# Altium schematic sheet acf_schematic_gost.SchDoc: Устройство сжатия
size 1188 x 840 mm; CheckedBy: Леонидов В.В.; Author: Добротин А.А.; DocumentNumber: ИУ4.11.03.03.24.08.81.07.000 Э3; SheetNumber: 1; SheetTotal: 4; CompanyName1: МГТУ им. Н.Э.Баумана; CompanyName2: Кафедра ИУ4; CompanyName3: Группа ИУ4-81Б; Title2str: аудиоданных; DocumentType: Схема электрическая принципиальная; FirstReferrence: ИУ4.11.03.03.24.08.81.07.000; SheetN: 1; SheetT: 1; ListNumber: 1; Разработал: Добротин А.А.; Проверил: Леонидов В.В.; Наименование1: Устройство для сжатия; Наименование2: аудиоданных; Компания1: МГТУ им. Н.Э. Баумана; Компания: Кафедра ИУ4; Компания2: Группа ИУ4-81Б; Обозначение: ИУ4.11.03.03.24.08.81.07.000 Э3; ТипДокумента: Схема электрическая принципиальная; Лист: 1; Листов: 1
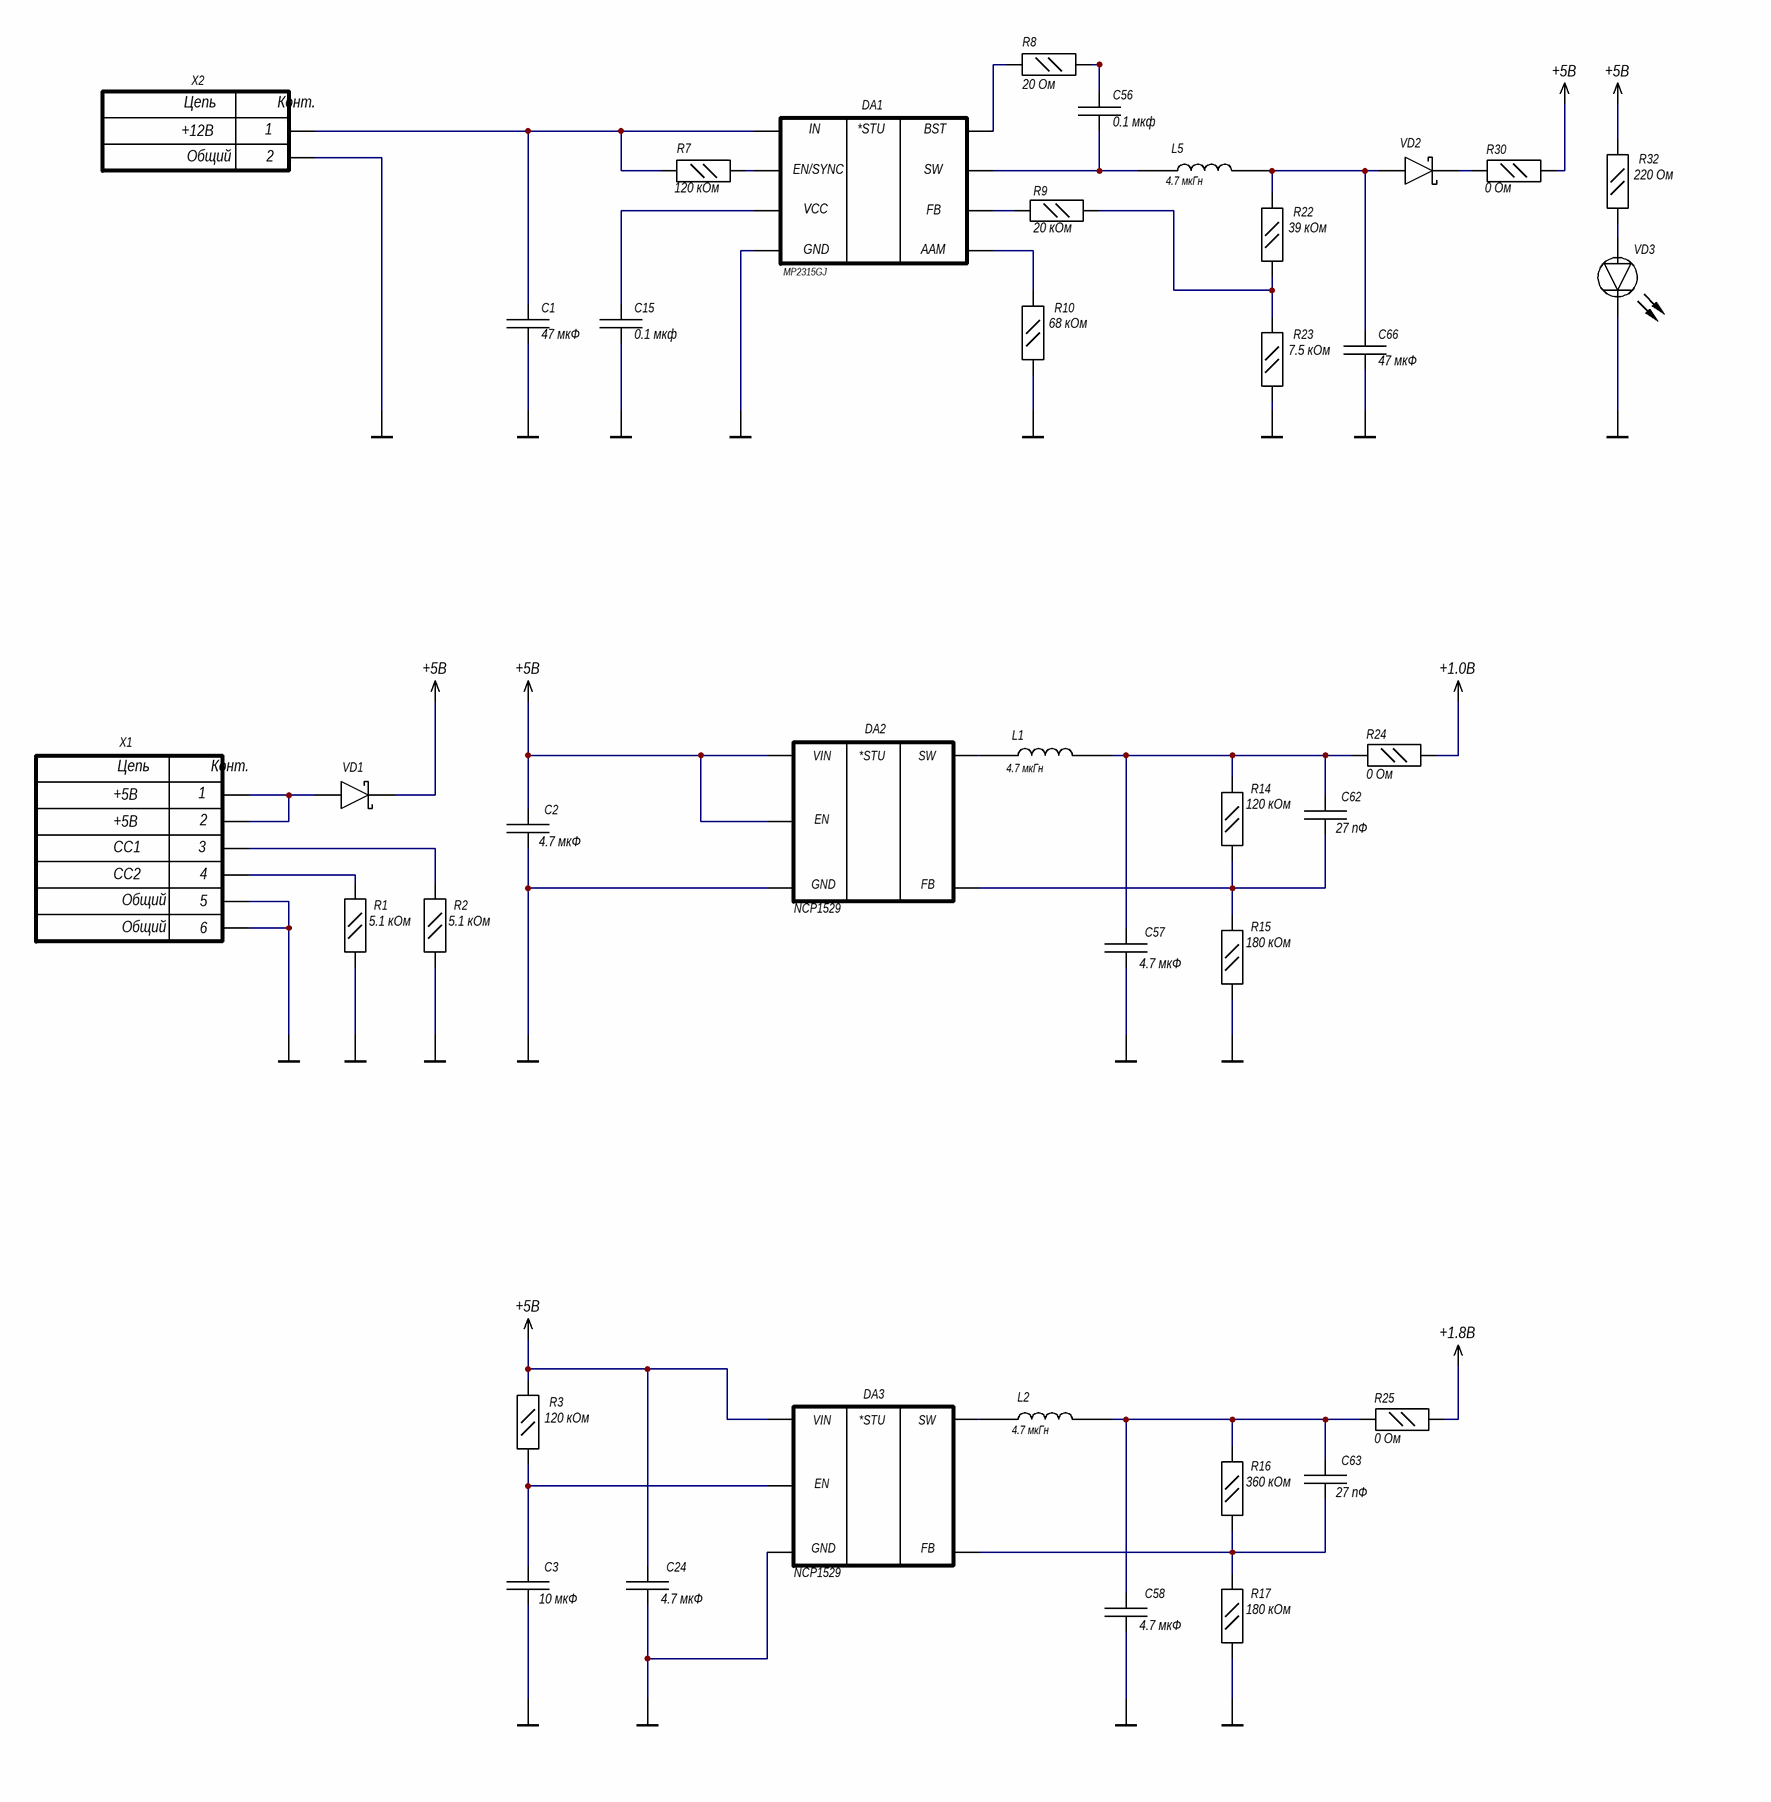
[diagram p0: acf_schematic_gost.SchDoc, top left]
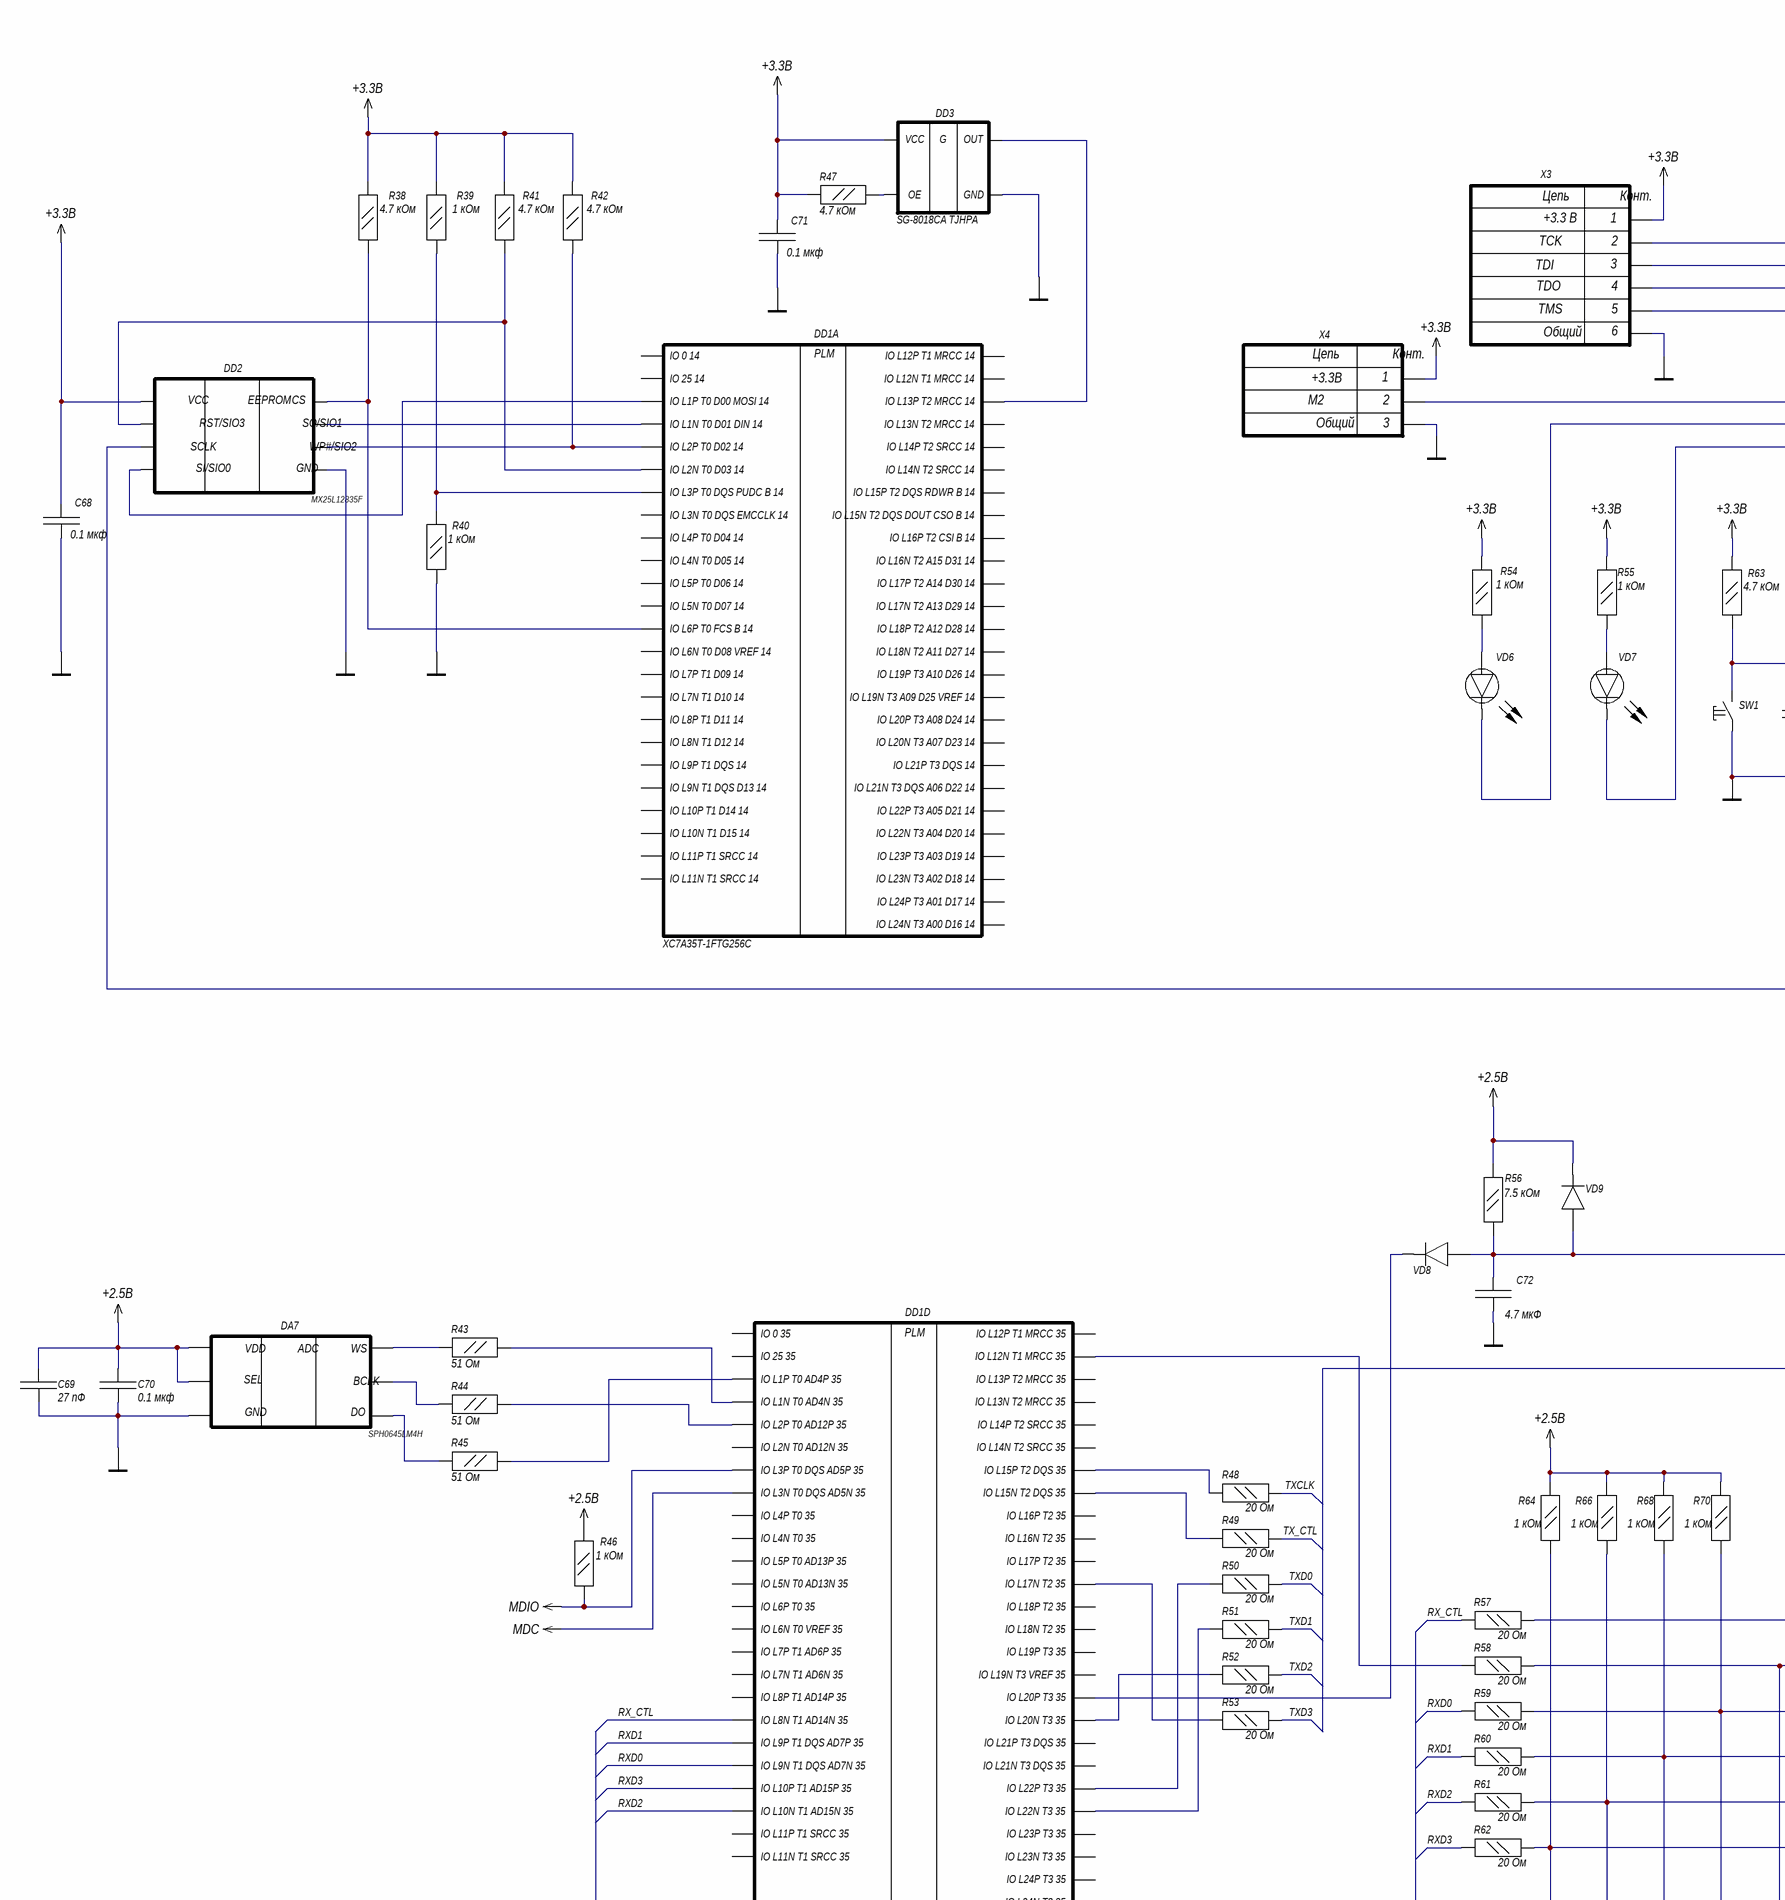
[diagram p1: acf_schematic_gost.SchDoc, top middle]
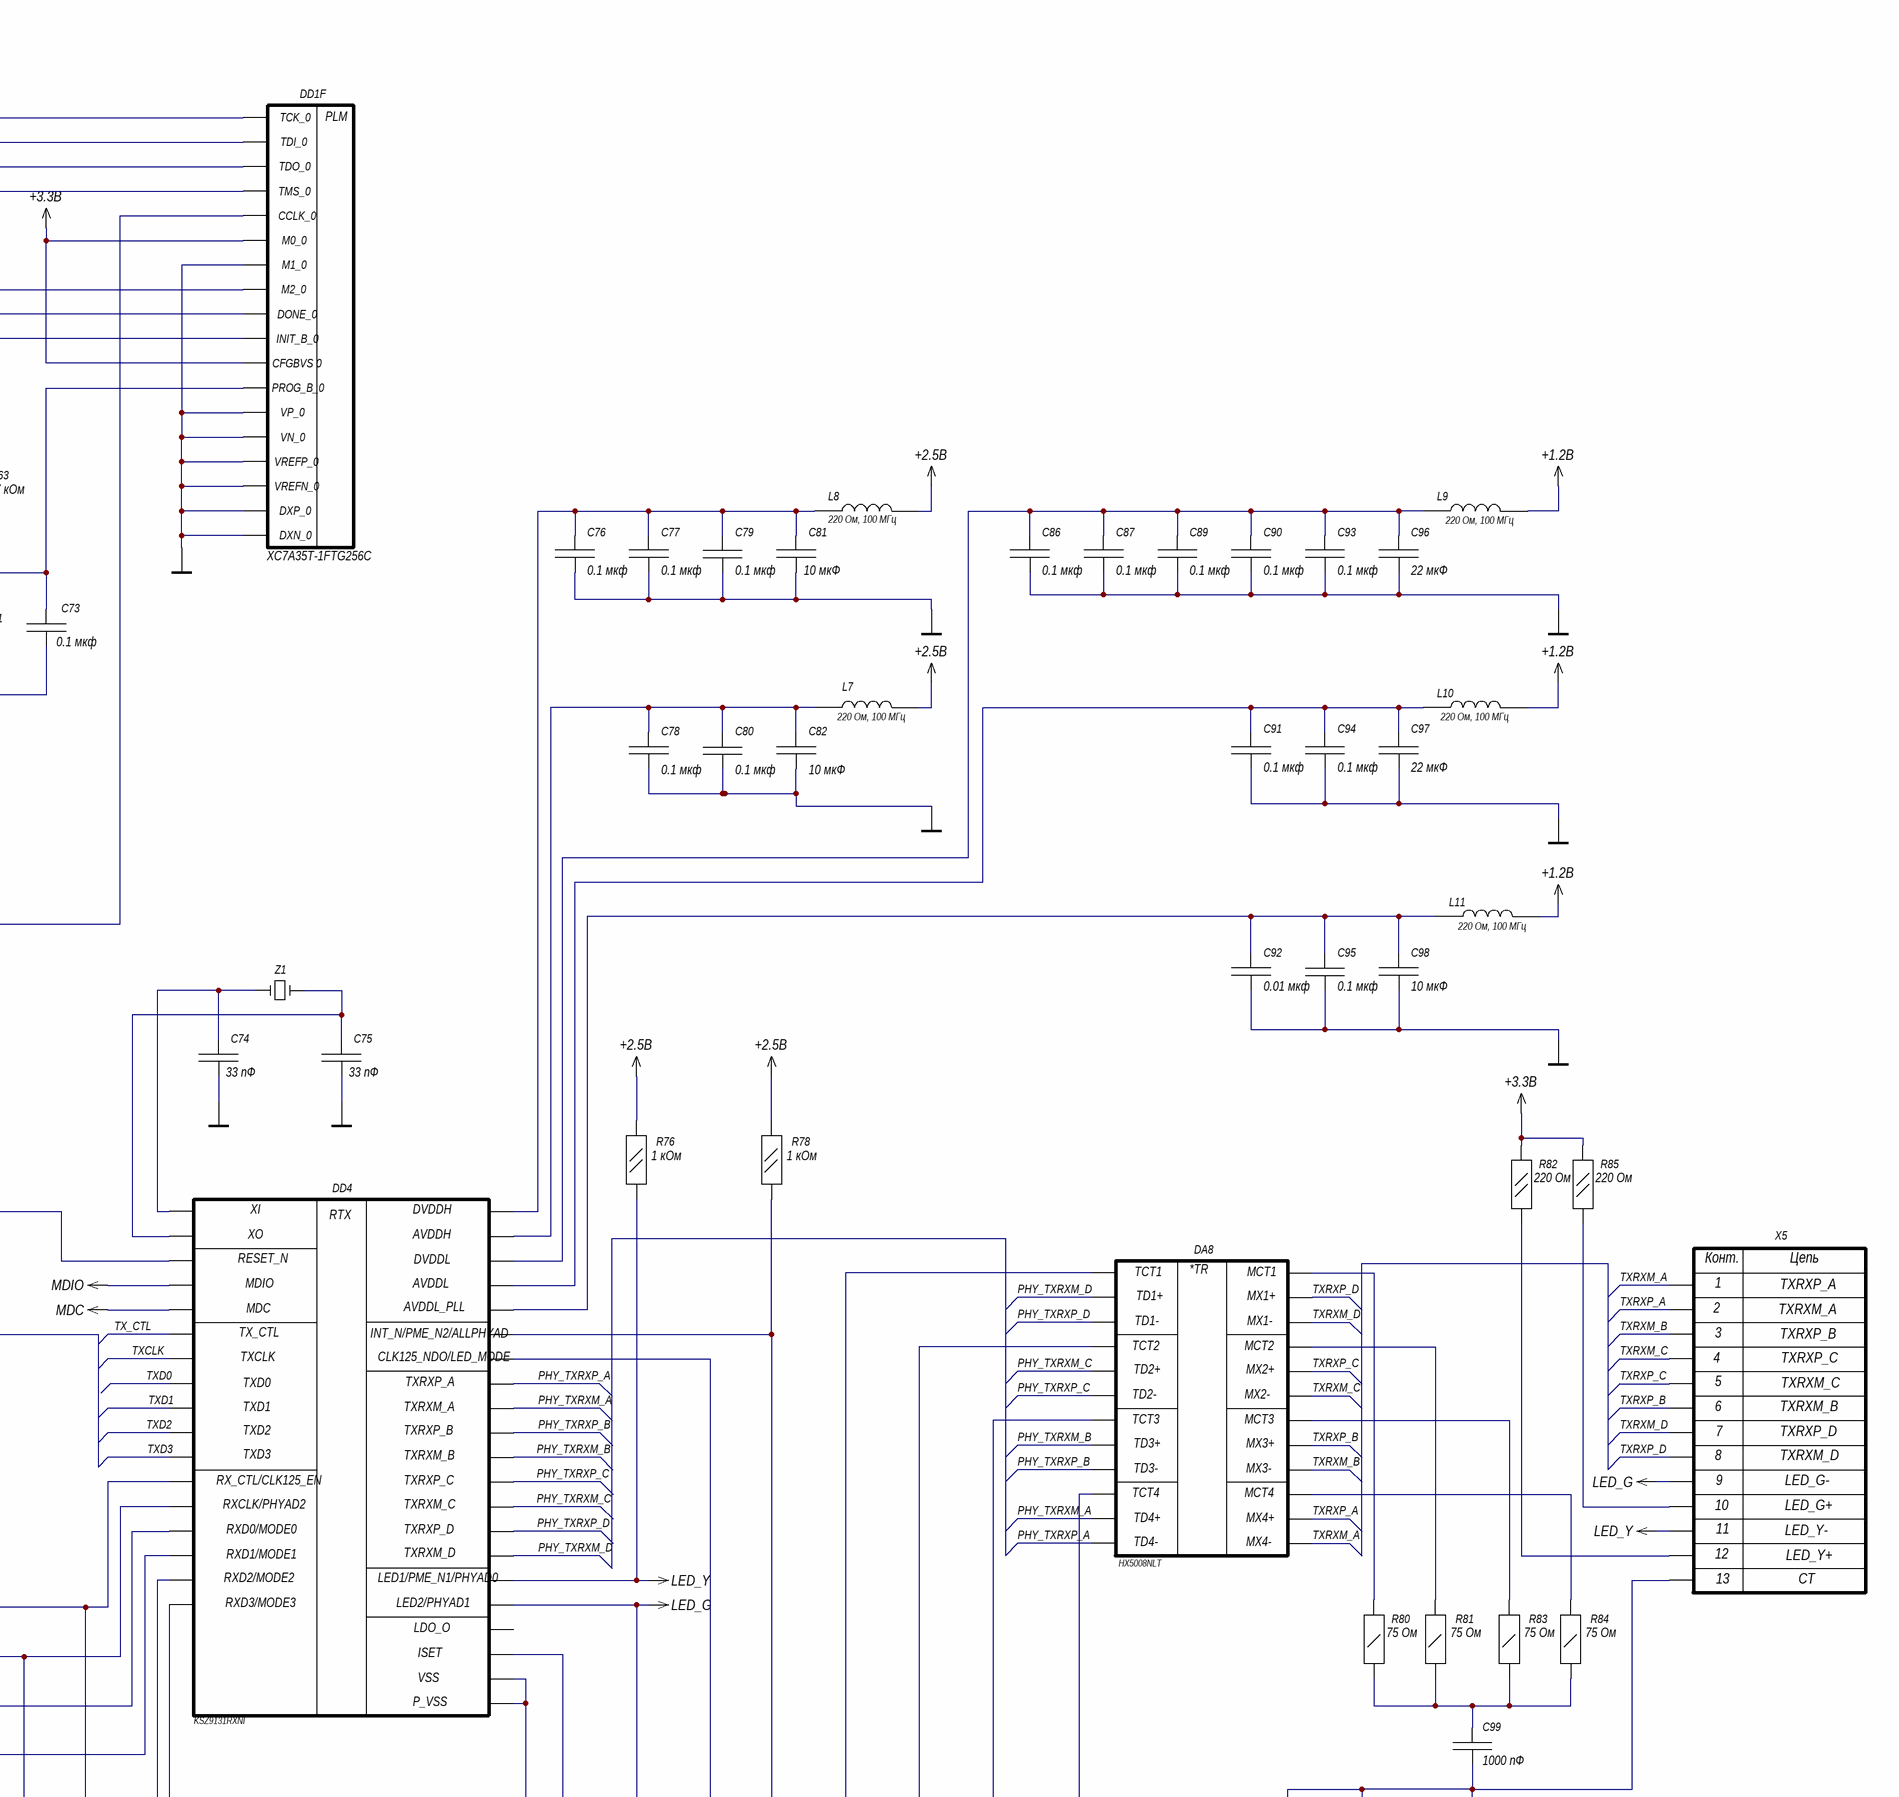
[diagram p2: acf_schematic_gost.SchDoc, top right]
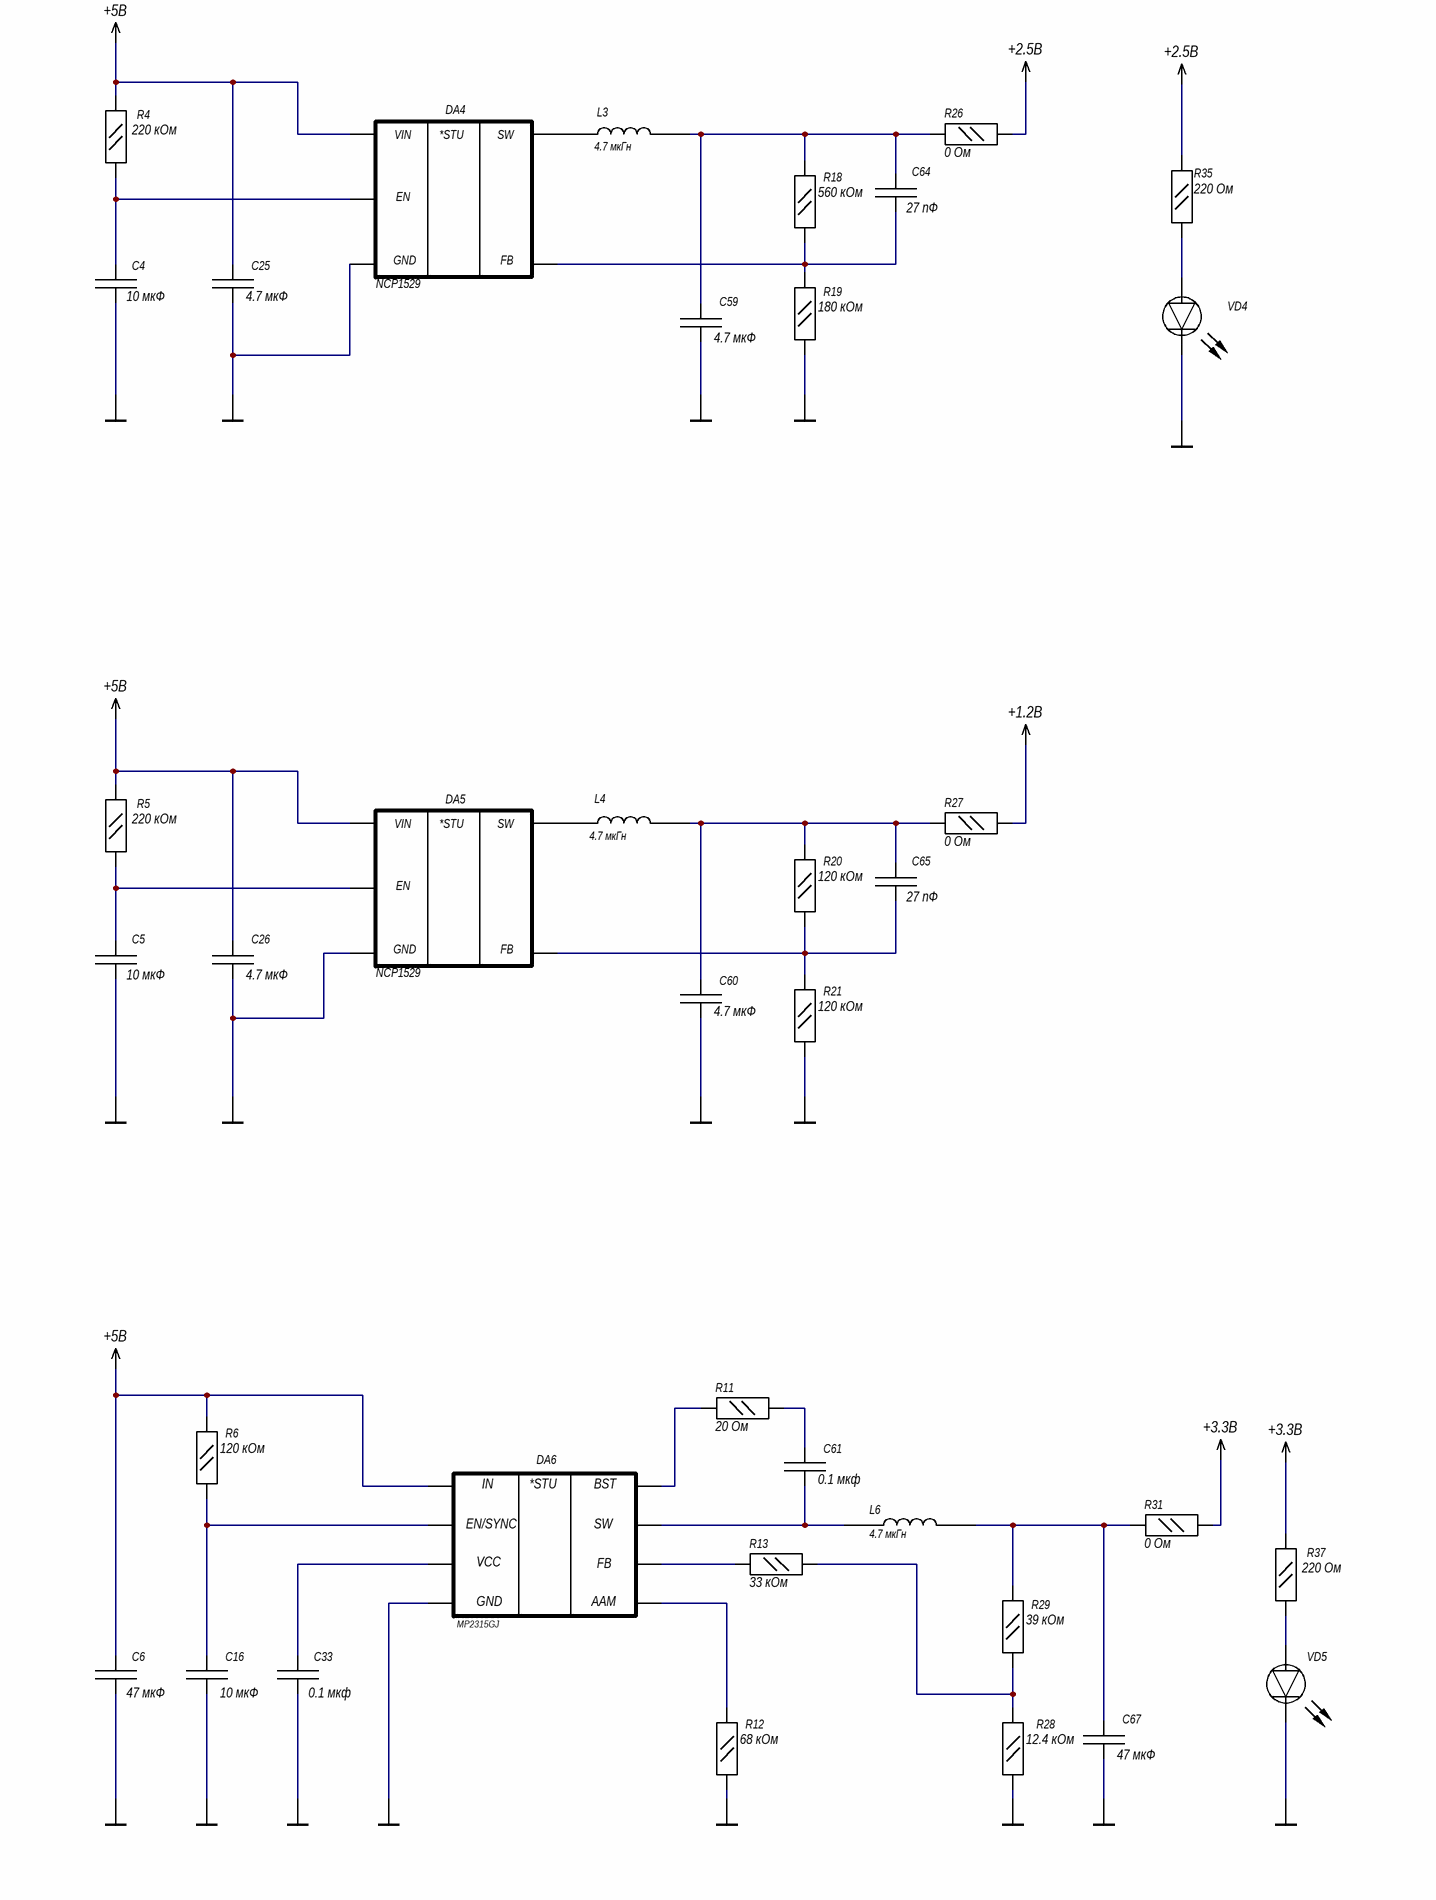
[diagram p3: acf_schematic_gost.SchDoc, bottom left]
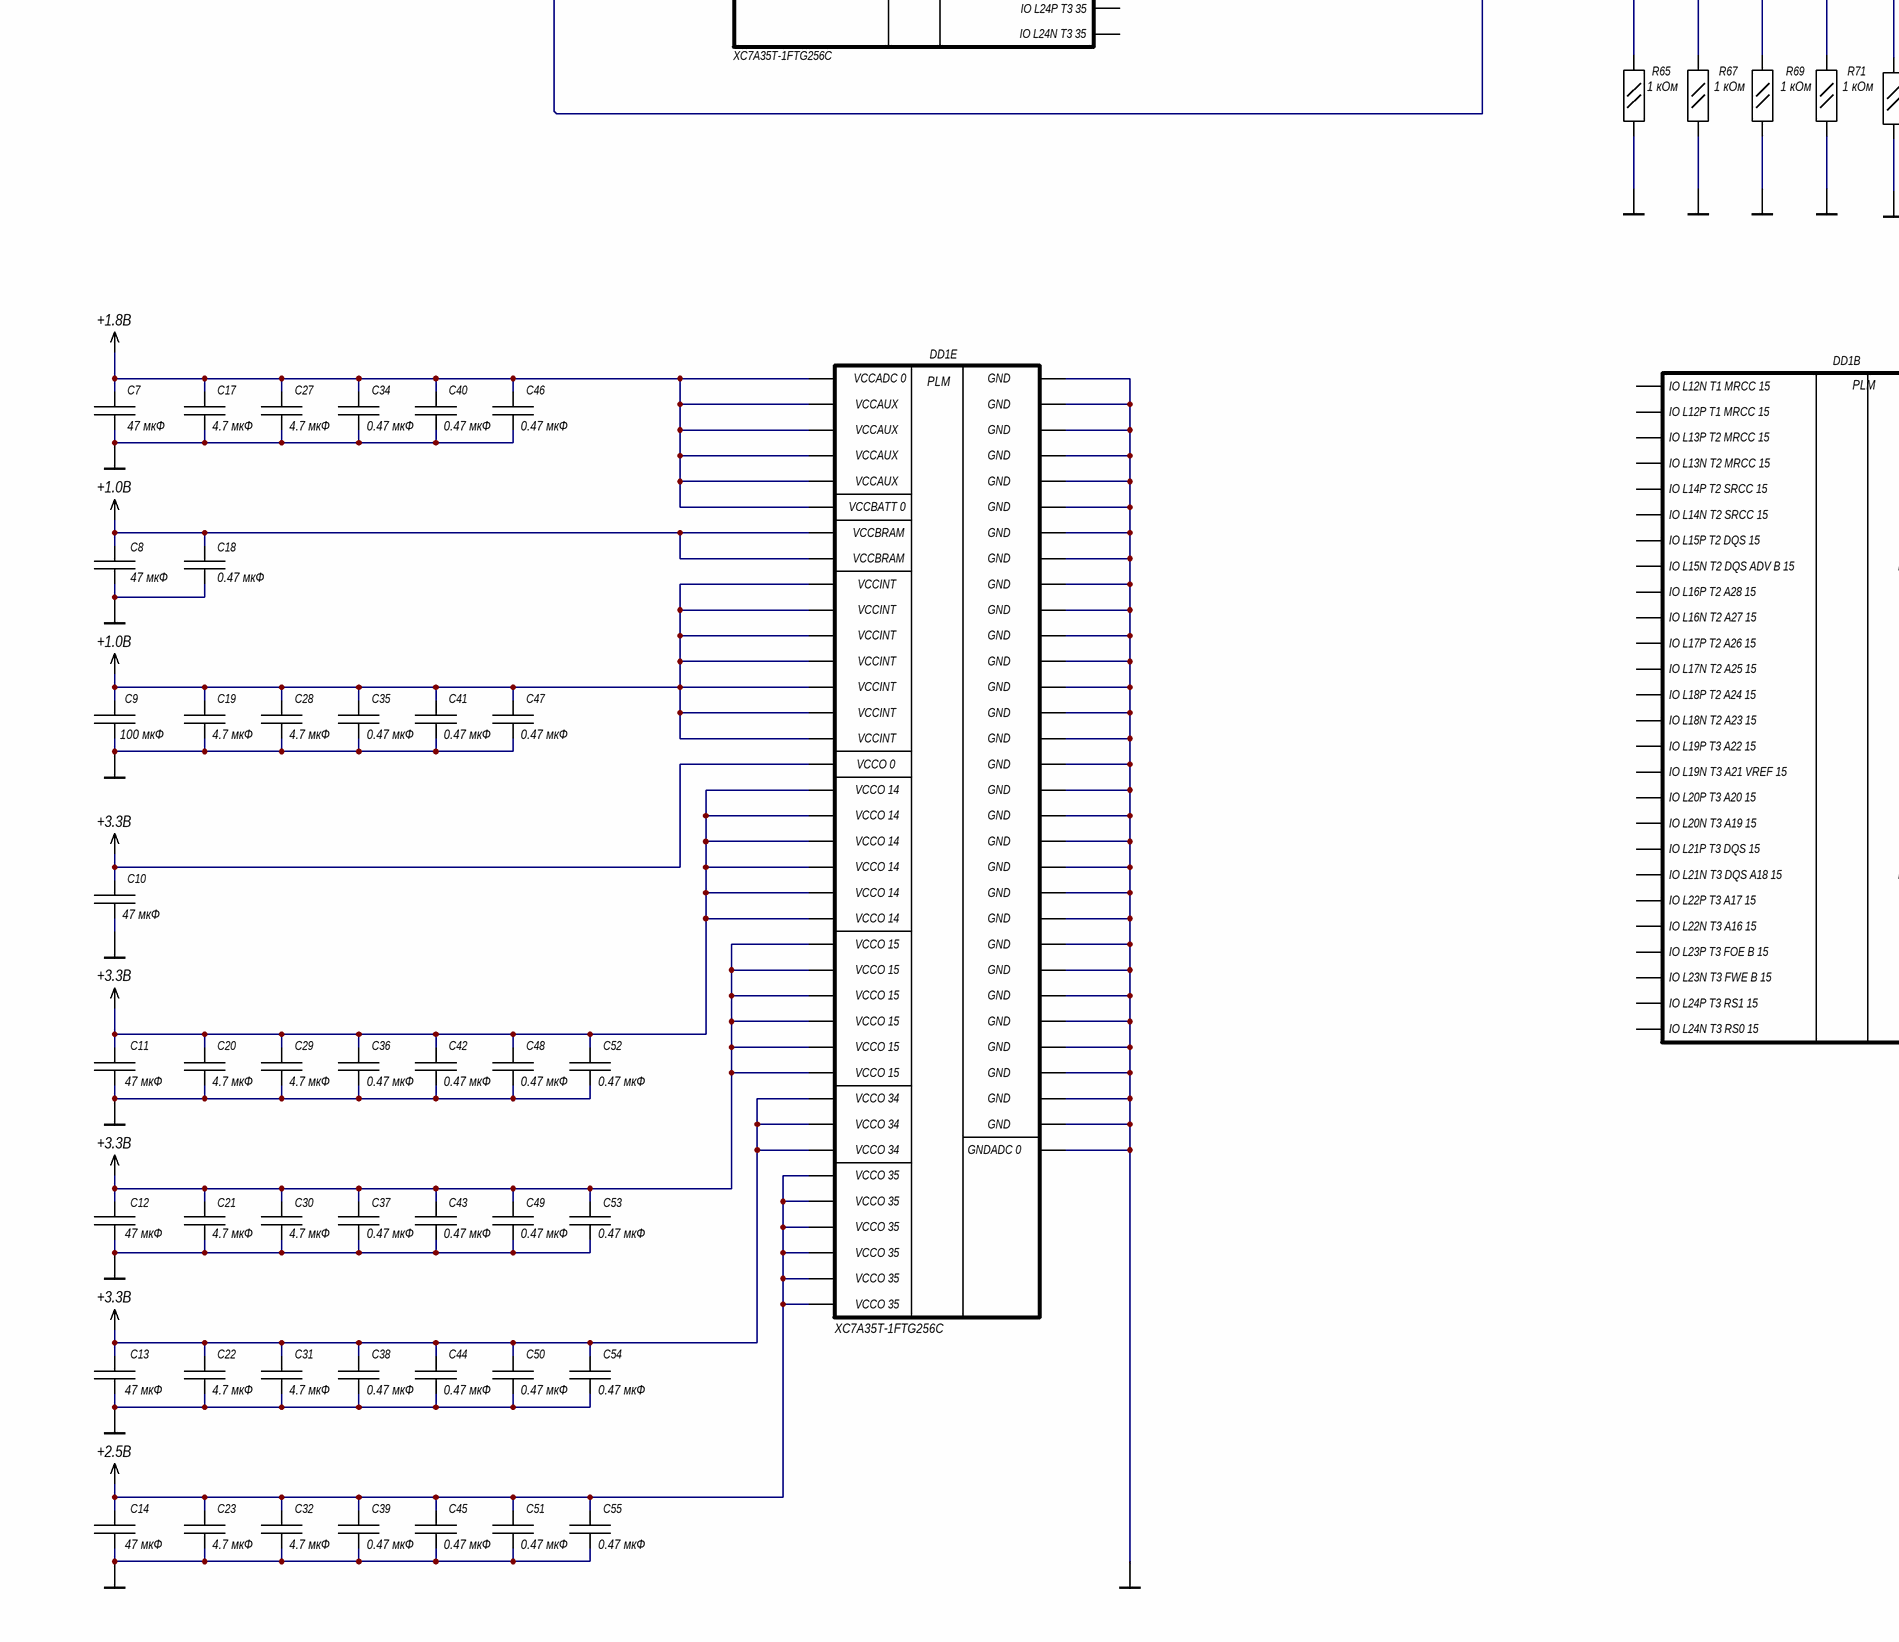
[diagram p4: acf_schematic_gost.SchDoc, bottom middle]
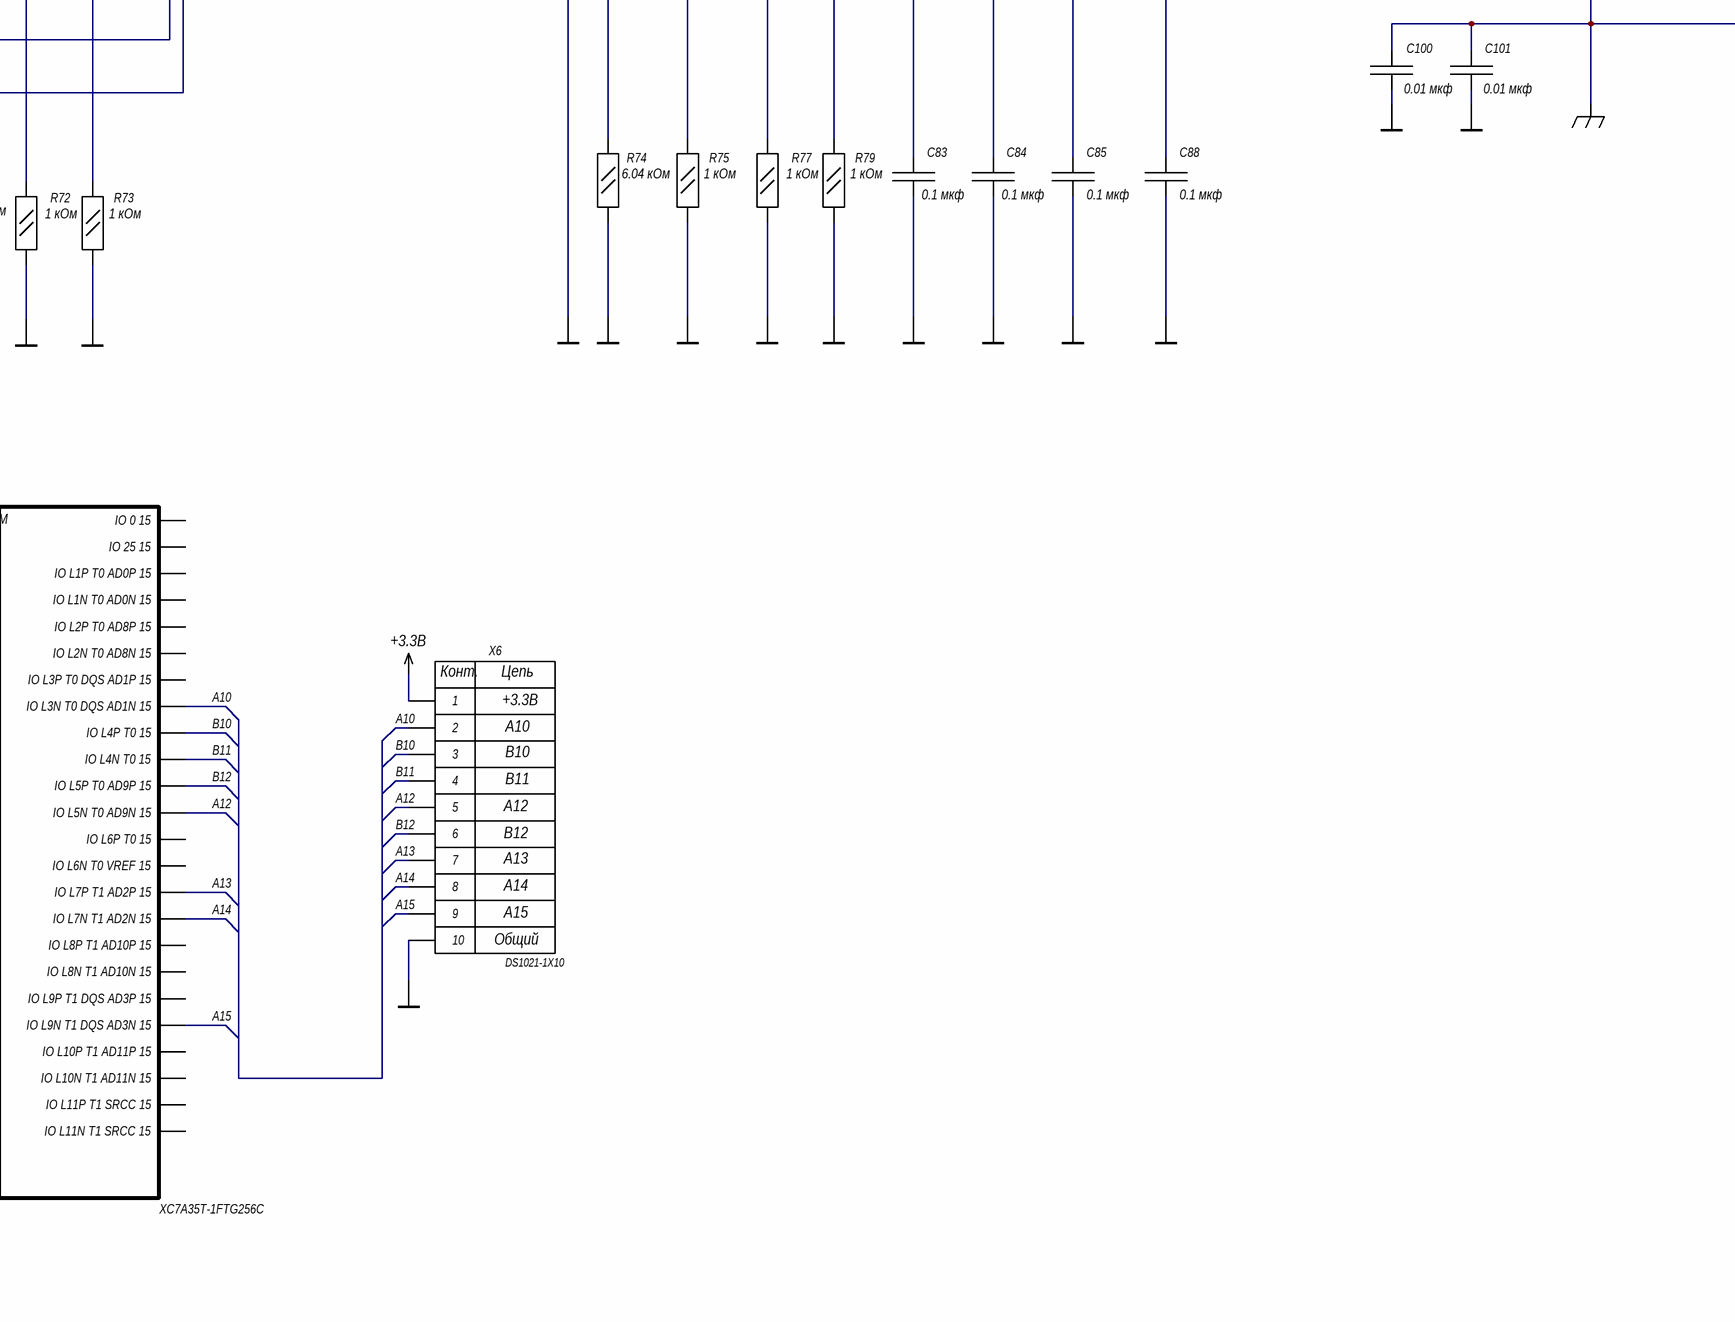
[diagram p5: acf_schematic_gost.SchDoc, bottom right]

## Parts
C1  47 мкф  [1206_Med_Dens_murata]
C2  CL10A475KP8NNNC  [CC0603-DA-IPC_B]  (value not drawn)
C3  Значение: 10 мкФ  [CC0603-DA-IPC_B]  (hidden comment: CL10A106KQ8NNNC)
C4  Значение: 10 мкФ  [CC0603-DA-IPC_B]  (hidden comment: CL10A106KQ8NNNC)
C5  Значение: 10 мкФ  [CC0603-DA-IPC_B]  (hidden comment: CL10A106KQ8NNNC)
C6  47 мкф  [0805_MED_DENS_MURATA]
C7  47 мкф  [0805_MED_DENS_MURATA]
C8  47 мкф  [0805_MED_DENS_MURATA]
C9  100 мкФ  [1206_IPC_A_samsung]
C10  47 мкф  [0805_MED_DENS_MURATA]
C11  47 мкф  [0805_MED_DENS_MURATA]
C12  47 мкф  [0805_MED_DENS_MURATA]
C13  47 мкф  [0805_MED_DENS_MURATA]
C14  47 мкф  [0805_MED_DENS_MURATA]
C15  Значение: 0.1 мкф  [CC0603-DA-IPC_B]  (hidden comment: 0.1 мкф (0603))
C16  Значение: 10 мкФ  [CC0603-DA-IPC_B]  (hidden comment: CL10A106KQ8NNNC)
C17  4.7 мкф  [CC0603-DA-IPC_B]
C18  0.47 мкф  [CC0603-DA-IPC_B]
C19  4.7 мкф  [CC0603-DA-IPC_B]
C20  4.7 мкф  [CC0603-DA-IPC_B]
C21  4.7 мкф  [CC0603-DA-IPC_B]
C22  4.7 мкф  [CC0603-DA-IPC_B]
C23  4.7 мкф  [CC0603-DA-IPC_B]
C24  CL10A475KP8NNNC  [CC0603-DA-IPC_B]  (value not drawn)
C25  CL10A475KP8NNNC  [CC0603-DA-IPC_B]  (value not drawn)
C26  CL10A475KP8NNNC  [CC0603-DA-IPC_B]  (value not drawn)
C27  4.7 мкф  [CC0603-DA-IPC_B]
C28  4.7 мкф  [CC0603-DA-IPC_B]
C29  4.7 мкф  [CC0603-DA-IPC_B]
C30  4.7 мкф  [CC0603-DA-IPC_B]
C31  4.7 мкф  [CC0603-DA-IPC_B]
C32  4.7 мкф  [CC0603-DA-IPC_B]
C33  Значение: 0.1 мкф  [CC0603-DA-IPC_B]  (hidden comment: 0.1 мкф (0603))
C34  0.47 мкф  [CC0603-DA-IPC_B]
C35  0.47 мкф  [CC0603-DA-IPC_B]
C36  0.47 мкф  [CC0603-DA-IPC_B]
C37  0.47 мкф  [CC0603-DA-IPC_B]
C38  0.47 мкф  [CC0603-DA-IPC_B]
C39  0.47 мкф  [CC0603-DA-IPC_B]
C40  0.47 мкф  [CC0603-DA-IPC_B]
C41  0.47 мкф  [CC0603-DA-IPC_B]
C42  0.47 мкф  [CC0603-DA-IPC_B]
C43  0.47 мкф  [CC0603-DA-IPC_B]
C44  0.47 мкф  [CC0603-DA-IPC_B]
C45  0.47 мкф  [CC0603-DA-IPC_B]
C46  0.47 мкф  [CC0603-DA-IPC_B]
C47  0.47 мкф  [CC0603-DA-IPC_B]
C48  0.47 мкф  [CC0603-DA-IPC_B]
C49  0.47 мкф  [CC0603-DA-IPC_B]
C50  0.47 мкф  [CC0603-DA-IPC_B]
C51  0.47 мкф  [CC0603-DA-IPC_B]
C52  0.47 мкф  [CC0603-DA-IPC_B]
C53  0.47 мкф  [CC0603-DA-IPC_B]
C54  0.47 мкф  [CC0603-DA-IPC_B]
C55  0.47 мкф  [CC0603-DA-IPC_B]
C56  Значение: 0.1 мкф  [CC0603-DA-IPC_B]  (hidden comment: 0.1 мкф (0603))
C57  CL10A475KP8NNNC  [CC0603-DA-IPC_B]  (value not drawn)
C58  CL10A475KP8NNNC  [CC0603-DA-IPC_B]  (value not drawn)
C59  CL10A475KP8NNNC  [CC0603-DA-IPC_B]  (value not drawn)
C60  CL10A475KP8NNNC  [CC0603-DA-IPC_B]  (value not drawn)
C61  Значение: 0.1 мкф  [CC0603-DA-IPC_B]  (hidden comment: 0.1 мкф (0603))
C62  CL21C270JBANNNC  [0805_MED_DENS_MURATA]  (value not drawn)
C63  CL21C270JBANNNC  [0805_MED_DENS_MURATA]  (value not drawn)
C64  CL21C270JBANNNC  [0805_MED_DENS_MURATA]  (value not drawn)
C65  CL21C270JBANNNC  [0805_MED_DENS_MURATA]  (value not drawn)
C66  GRM21BR60J476ME15L  [0805_MED_DENS_MURATA]  (value not drawn)
C67  GRM21BR60J476ME15L  [0805_MED_DENS_MURATA]  (value not drawn)
C68  Значение: 0.1 мкф  [CC0603-DA-IPC_B]  (hidden comment: 0.1 мкф (0603))
C69  27 пф  [0805_MED_DENS_MURATA]
C70  Значение: 0.1 мкф  [CC0603-DA-IPC_B]  (hidden comment: 0.1 мкф (0603))
C71  Значение: 0.1 мкф  [CC0603-DA-IPC_B]  (hidden comment: 0.1 мкф (0603))
C72  4.7 мкф  [CC0603-DA-IPC_B]
C73  Значение: 0.1 мкф  [CC0603-DA-IPC_B]  (hidden comment: 0.1 мкф (0603))
C74  33 пФ  [CC0603-DA-IPC_B]
C75  33 пФ  [CC0603-DA-IPC_B]
C76  Значение: 0.1 мкф  [CC0603-DA-IPC_B]  (hidden comment: 0.1 мкф (0603))
C77  Значение: 0.1 мкф  [CC0603-DA-IPC_B]  (hidden comment: 0.1 мкф (0603))
C78  Значение: 0.1 мкф  [CC0603-DA-IPC_B]  (hidden comment: 0.1 мкф (0603))
C79  Значение: 0.1 мкф  [CC0603-DA-IPC_B]  (hidden comment: 0.1 мкф (0603))
C80  Значение: 0.1 мкф  [CC0603-DA-IPC_B]  (hidden comment: 0.1 мкф (0603))
C81  10 мкф  [CC0603-DA-IPC_B]
C82  10 мкф  [CC0603-DA-IPC_B]
C83  Значение: 0.1 мкф  [CC0603-DA-IPC_B]  (hidden comment: 0.1 мкф (0603))
C84  Значение: 0.1 мкф  [CC0603-DA-IPC_B]  (hidden comment: 0.1 мкф (0603))
C85  Значение: 0.1 мкф  [CC0603-DA-IPC_B]  (hidden comment: 0.1 мкф (0603))
C86  Значение: 0.1 мкф  [CC0603-DA-IPC_B]  (hidden comment: 0.1 мкф (0603))
C87  Значение: 0.1 мкф  [CC0603-DA-IPC_B]  (hidden comment: 0.1 мкф (0603))
C88  Значение: 0.1 мкф  [CC0603-DA-IPC_B]  (hidden comment: 0.1 мкф (0603))
C89  Значение: 0.1 мкф  [CC0603-DA-IPC_B]  (hidden comment: 0.1 мкф (0603))
C90  Значение: 0.1 мкф  [CC0603-DA-IPC_B]  (hidden comment: 0.1 мкф (0603))
C91  Значение: 0.1 мкф  [CC0603-DA-IPC_B]  (hidden comment: 0.1 мкф (0603))
C92  0.01 мкф  [CC0603-DA-IPC_B]
C93  Значение: 0.1 мкф  [CC0603-DA-IPC_B]  (hidden comment: 0.1 мкф (0603))
C94  Значение: 0.1 мкф  [CC0603-DA-IPC_B]  (hidden comment: 0.1 мкф (0603))
C95  Значение: 0.1 мкф  [CC0603-DA-IPC_B]  (hidden comment: 0.1 мкф (0603))
C96  22 мкФ  [0805_MED_DENS_MURATA]
C97  22 мкФ  [0805_MED_DENS_MURATA]
C98  10 мкф  [CC0603-DA-IPC_B]
C99  1000 пФ  [CAP 1808]
C100  0.01 мкф  [CC0603-DA-IPC_B]
C101  0.01 мкф  [CC0603-DA-IPC_B]
DA1  DC-DC  [TSTO23-8]  (value not drawn)
DA2  DC-DC  [TSOT23-5 (TSOP5)]  (value not drawn)
DA3  DC-DC  [TSOT23-5 (TSOP5)]  (value not drawn)
DA4  DC-DC  [TSOT23-5 (TSOP5)]  (value not drawn)
DA5  DC-DC  [TSOT23-5 (TSOP5)]  (value not drawn)
DA6  DC-DC  [TSTO23-8]  (value not drawn)
DA7  Microphone  [MIC_SPH0645LM4H-B]  (value not drawn)
DA8  Magnetics (ethernet)  [FP-HX5008NL-MFG]  (value not drawn)
DD1  FPGA  [FP-XC7A35T-1FTG256C-MFG]  (value not drawn)  (parts A,B,D,E,F of 6)
DD2  QSPI Flash  [MX25L12835FM2I-10G]  (value not drawn)
DD3  SG-8018CA TJHPA  [OSC_SG-8018CA_50.2600M-TJHPA0]  (value not drawn)
DD4  PHY ETH  [FP-QFN77-48LD-PL-1-MFG]  (value not drawn)
L1  VLS6045EX-4R7M-H  [IND_VLS6045EX-4R7M-H]  (value not drawn)
L2  VLS6045EX-4R7M-H  [IND_VLS6045EX-4R7M-H]  (value not drawn)
L3  VLS6045EX-4R7M-H  [IND_VLS6045EX-4R7M-H]  (value not drawn)
L4  VLS6045EX-4R7M-H  [IND_VLS6045EX-4R7M-H]  (value not drawn)
L5  VLS6045EX-4R7M-H  [IND_VLS6045EX-4R7M-H]  (value not drawn)
L6  VLS6045EX-4R7M-H  [IND_VLS6045EX-4R7M-H]  (value not drawn)
L7  Значение: 220 Ом, 100 МГц  [MMZ1608-0_8-MFG]  (hidden comment: Ферритовый фильтр 220 Ом 100 МГц)
L8  Значение: 220 Ом, 100 МГц  [MMZ1608-0_8-MFG]  (hidden comment: Ферритовый фильтр 220 Ом 100 МГц)
L9  Значение: 220 Ом, 100 МГц  [MMZ1608-0_8-MFG]  (hidden comment: Ферритовый фильтр 220 Ом 100 МГц)
L10  Значение: 220 Ом, 100 МГц  [MMZ1608-0_8-MFG]  (hidden comment: Ферритовый фильтр 220 Ом 100 МГц)
L11  Значение: 220 Ом, 100 МГц  [MMZ1608-0_8-MFG]  (hidden comment: Ферритовый фильтр 220 Ом 100 МГц)
R1  5.1 кОм  [RESC2012X60N (0805)]
R2  5.1 кОм  [RESC2012X60N (0805)]
R3  120 кОм  [RESC2012X60N (0805)]
R4  RC0603FR-07220KL  [RESC1608X55X25(0603 res)]  (value not drawn)
R5  RC0603FR-07220KL  [RESC1608X55X25(0603 res)]  (value not drawn)
R6  120 кОм  [RESC2012X60N (0805)]
R7  120 кОм  [RESC2012X60N (0805)]
R8  20 Ом  [RESC2012X60N (0805)]
R9  20 кОм  [RESC1608X55X25(0603 res)]
R10  68 кОм  [RESC2012X60N (0805)]
R11  20 Ом  [RESC2012X60N (0805)]
R12  68 кОм  [RESC2012X60N (0805)]
R13  33 кОм  [RESC2012X60N (0805)]
R14  120 кОм  [RESC2012X60N (0805)]
R15  RC0603FR-07180KL  [RESC1608X55X25(0603 res)]  (value not drawn)
R16  RC0805FR-07360KL  [RESC2012X60N (0805)]  (value not drawn)
R17  RC0603FR-07180KL  [RESC1608X55X25(0603 res)]  (value not drawn)
R18  560 кОм  [RESC2012X60N (0805)]
R19  180 кОм  [RESC1608X55X25(0603 res)]
R20  120 кОм  [RESC2012X60N (0805)]
R21  120 кОм  [RESC2012X60N (0805)]
R22  39 кОм  [RESC1608X55X25(0603 res)]
R23  7.5 кОм  [RESC1608X55X25(0603 res)]
R24  0 Ом  [RESC2012X60N (0805)]
R25  0 Ом  [RESC2012X60N (0805)]
R26  0 Ом  [RESC2012X60N (0805)]
R27  0 Ом  [RESC2012X60N (0805)]
R28  12.4 кОм  [RESC1608X55X25(0603 res)]
R29  39 кОм  [RESC1608X55X25(0603 res)]
R30  0 Ом  [RESC2012X60N (0805)]
R31  0 Ом  [RESC2012X60N (0805)]
R32  220 Ом  [RESC2012X60N (0805)]
R35  220 Ом  [RESC2012X60N (0805)]
R37  220 Ом  [RESC2012X60N (0805)]
R38  4.7 кОм  [RESC2012X60N (0805)]
R39  1 кОм  [RESC2012X60N (0805)]
R40  1 кОм  [RESC2012X60N (0805)]
R41  4.7 кОм  [RESC2012X60N (0805)]
R42  4.7 кОм  [RESC2012X60N (0805)]
R43  51 Ом  [RESC2012X60N (0805)]
R44  51 Ом  [RESC2012X60N (0805)]
R45  51 Ом  [RESC2012X60N (0805)]
R46  1 кОм  [RESC2012X60N (0805)]
R47  4.7 кОм  [RESC2012X60N (0805)]
R48  20 Ом  [RESC2012X60N (0805)]
R49  20 Ом  [RESC2012X60N (0805)]
R50  20 Ом  [RESC2012X60N (0805)]
R51  20 Ом  [RESC2012X60N (0805)]
R52  20 Ом  [RESC2012X60N (0805)]
R53  20 Ом  [RESC2012X60N (0805)]
R54  1 кОм  [RESC2012X60N (0805)]
R55  1 кОм  [RESC2012X60N (0805)]
R56  7.5 кОм  [RESC1608X55X25(0603 res)]
R57  20 Ом  [RESC2012X60N (0805)]
R58  20 Ом  [RESC2012X60N (0805)]
R59  20 Ом  [RESC2012X60N (0805)]
R60  20 Ом  [RESC2012X60N (0805)]
R61  20 Ом  [RESC2012X60N (0805)]
R62  20 Ом  [RESC2012X60N (0805)]
R63  4.7 кОм  [RESC2012X60N (0805)]
R64  1 кОм  [RESC2012X60N (0805)]
R65  1 кОм  [RESC2012X60N (0805)]
R66  1 кОм  [RESC2012X60N (0805)]
R67  1 кОм  [RESC2012X60N (0805)]
R68  1 кОм  [RESC2012X60N (0805)]
R69  1 кОм  [RESC2012X60N (0805)]
R70  1 кОм  [RESC2012X60N (0805)]
R71  1 кОм  [RESC2012X60N (0805)]
R72  1 кОм  [RESC2012X60N (0805)]
R73  1 кОм  [RESC2012X60N (0805)]
R74  6.04 кОм  [RESC2012X60N (0805)]
R75  1 кОм  [RESC2012X60N (0805)]
R76  1 кОм  [RESC2012X60N (0805)]
R77  1 кОм  [RESC2012X60N (0805)]
R78  1 кОм  [RESC2012X60N (0805)]
R79  1 кОм  [RESC2012X60N (0805)]
R80  75 Ом  [RC1206-IPC_A]
R81  75 Ом  [RC1206-IPC_A]
R82  220 Ом  [RESC2012X60N (0805)]
R83  75 Ом  [RC1206-IPC_A]
R84  75 Ом  [RC1206-IPC_A]
R85  220 Ом  [RESC2012X60N (0805)]
SW1  Кнопка  [BUTTON]  (value not drawn)
VD1  Schottky diode, 5A, 30V (360 mV)  [SOD128-MFG]  (value not drawn)
VD2  Schottky diode, 5A, 30V (360 mV)  [SOD128-MFG]  (value not drawn)
VD3  green led  [KING-0603LED_GREEN_V]  (value not drawn)
VD4  green led  [KING-0603LED_GREEN_V]  (value not drawn)
VD5  green led  [KING-0603LED_GREEN_V]  (value not drawn)
VD6  blue led  [KING-0603LED_GREEN_V]  (value not drawn)
VD7  blue led  [KING-0603LED_GREEN_V]  (value not drawn)
VD8  diode  [FP-SOD-123-MFG]  (value not drawn)
VD9  diode  [FP-SOD-123-MFG]  (value not drawn)
X1  USB Type-C  [USB TYPE-C 6 pins]  (value not drawn)
X2  DC005 5,5x2,1 mm  [DC POWER JACK (5.5x2.5mm)]  (value not drawn)
X3  14 pin header (jtag)  [SAMTEC-TST-107-01 (14PIN)]  (value not drawn)
X4  3 pin header (BOOT)  [PLS-3 (DS1021-1x3)]  (value not drawn)
X5  ethernet connector  [RJHSE-5381_ETHERNET]  (value not drawn)
X6  10 pin header  [10 Pin Header]  (value not drawn)
Z1  Crystal resonator 25 MHz  [HC49/S (CRYSTAL)]  (value not drawn)

## Nets
+1.0В: C8.2 C9.1 C18.1 C19.2 C28.2 C35.1 C41.2 C47.2 DD1.E10(VCCBRAM) DD1.F7(VCCINT) DD1.F9(VCCINT) DD1.F11(VCCBRAM) DD1.G6(VCCINT) DD1.H9(VCCINT) DD1.J6(VCCINT) DD1.K9(VCCINT) DD1.L8(VCCINT) R24.2
+1.2В: L9.2 L10.2 L11.2 R27.2
+1.8В: C7.2 C17.2 C27.2 C34.1 C40.2 C46.2 DD1.F8(VCCBATT_0) DD1.G8(VCCADC_0) DD1.G10(VCCAUX) DD1.J10(VCCAUX) DD1.K11(VCCAUX) DD1.L10(VCCAUX) R25.2
+2.5В: C14.2 C23.2 C32.2 C39.1 C45.2 C51.2 C55.2 C69.2 C70.2 DA7.2(SEL) DA7.5(VDD) DD1.A6(VCCO_35) DD1.B3(VCCO_35) DD1.D7(VCCO_35) DD1.E4(VCCO_35) DD1.F1(VCCO_35) DD1.J2(VCCO_35) L7.2 L8.1 R26.2 R35.2 R46.2 R56.2 R64.1 R66.1 R68.1 R70.1 R76.2 R78.2 VD9.1(K)
+3.3В: C10.2 C11.2 C12.2 C13.2 C20.1 C21.2 C22.2 C29.1 C30.2 C31.2 C36.1 C37.1 C38.1 C42.2 C43.2 C44.2 C48.2 C49.2 C50.2 C52.2 C53.2 C54.2 C68.2 C71.2 DD1.A16(VCCO_15) DD1.B13(VCCO_15) DD1.C10(VCCO_15) DD1.E7(CFGBVS_0) DD1.E14(VCCO_15) DD1.H15(VCCO_15) DD1.J12(VCCO_15) DD1.L6(VCCO_0) DD1.L16(VCCO_14) DD1.M3(VCCO_34) DD1.M9(M0_0) DD1.M13(VCCO_14) DD1.N10(VCCO_14) DD1.P7(VCCO_14) DD1.R4(VCCO_34) DD1.R14(VCCO_14) DD1.T1(VCCO_34) DD1.T11(VCCO_14) DD2.8 DD3.4(VCC) R31.2 R37.2 R38.2 R39.2 R41.2 R42.2 R47.2 R54.2 R55.2 R63.2 R82.2 R85.2 X3.2(VREF_(VCCO)) X4.1(VCC) X6.1
+5В: C2.2 C6.2 C24.2 C25.2 C26.2 DA2.1(EN) DA2.4(VIN) DA3.4(VIN) DA4.4(VIN) DA5.4(VIN) DA6.2(IN) R3.2 R4.2 R5.2 R6.2 R30.2 R32.2 VD1.1(C)
CHASSIS: C99.1 C100.2 C101.2 X5.S1,S2(S1)
GND: C1.1 C2.1 C3.1 C4.1 C5.1 C6.1 C7.1 C8.1 C9.2 C10.1 C11.1 C12.1 C13.1 C14.1 C15.2 C16.1 C17.1 C18.2 C19.1 C20.2 C21.1 C22.1 C23.1 C24.1 C25.1 C26.1 C27.1 C28.1 C29.2 C30.1 C31.1 C32.1 C33.2 C34.2 C35.2 C36.2 C37.2 C38.2 C39.2 C40.1 C41.1 C42.1 C43.1 C44.1 C45.1 C46.1 C47.1 C48.1 C49.1 C50.1 C51.1 C52.1 C53.1 C54.1 C55.1 C57.1 C58.1 C59.1 C60.1 C66.1 C67.1 C68.1 C69.1 C70.1 C71.1 C72.1 C73.1 C74.1 C75.1 C76.2 C77.2 C78.2 C79.1 C80.1 C81.2 C82.2 C83.1 C84.1 C85.1 C86.1 C87.1 C88.1 C89.1 C90.1 C91.1 C92.1 C93.1 C94.1 C95.2 C96.1 C97.1 C98.1 C100.1 C101.1 DA1.4(GND) DA2.2(GND) DA3.2(GND) DA4.2(GND) DA5.2(GND) DA6.4(GND) DA7.3(GND) DD1.A1(GND) DD1.A11(GND) DD1.B8(GND) DD1.C5(GND) DD1.C15(GND) DD1.D2(GND) DD1.D12(GND) DD1.E9(GND) DD1.F6(GND) DD1.F10(GND) DD1.F16(GND) DD1.G3(GND) DD1.G7(GNDADC_0) DD1.G9(GND) DD1.G13(GND) DD1.H6(GND) DD1.H7(VREFN_0) DD1.H8(VP_0) DD1.J7(VN_0) DD1.J8(VREFP_0) DD1.J9(GND) DD1.J11(GND) DD1.K4(GND) DD1.K6(GND) DD1.K7(DXN_0) DD1.K8(DXP_0) DD1.K14(GND) DD1.L1(GND) DD1.L11(GND) DD1.M8(GND) DD1.M10(M1_0) DD1.N5(GND) DD1.N15(GND) DD1.P2(GND) DD1.P12(GND) DD1.R9(GND) DD1.T6(GND) DD1.T16(GND) DD2.4 DD3.2(GND) DD4.29(VSS) DD4.49(P_VSS) R1.1 R2.1 R10.1 R12.2 R15.1 R17.1 R19.1 R21.1 R23.1 R28.2 R40.1 R65.2 R67.2 R69.2 R71.2 R72.2 R73.2 R74.2 R75.2 R77.1 R79.1 SW1.1 VD3.1(K) VD4.1(K) VD5.1(K) X1.A12(GND) X1.B12(GND) X2.1,2(GND) X3.3,5,7,9,11(GND) X4.3(GND) X6.10
LED_G: DD4.15(LED2) R75.1 X5.9
LED_Y: DD4.17(LED1) R76.1 X5.11
MDC: DD1.A4(IO_L3N_T0_DQS_AD5N_35) DD4.36(MDC)
MDIO: DD1.A5(IO_L3P_T0_DQS_AD5P_35) DD4.37(MDIO) R46.1
A10: DD1.A10(IO_L3N_T0_DQS_AD1N_15) X6.2
A12: DD1.A12(IO_L5N_T0_AD9N_15) X6.5
A13: DD1.A13(IO_L7P_T1_AD2P_15) X6.7
A14: DD1.A14(IO_L7N_T1_AD2N_15) X6.8
A15: DD1.A15(IO_L9N_T1_DQS_AD3N_15) X6.9
B10: DD1.B10(IO_L4P_T0_15) X6.3
B11: DD1.B11(IO_L4N_T0_15) X6.4
B12: DD1.B12(IO_L5P_T0_AD9P_15) X6.6
PHY_TXRXM_A: DA8.11 DD4.3(TXRXM_A)
PHY_TXRXM_B: DA8.8 DD4.6(TXRXM_B)
PHY_TXRXM_C: DA8.5 DD4.8(TXRXM_B)
PHY_TXRXM_D: DA8.2 DD4.11(TXRXM_D)
PHY_TXRXP_A: DA8.12 DD4.2(TXRXP_A)
PHY_TXRXP_B: DA8.9 DD4.5(TXRXP_B)
PHY_TXRXP_C: DA8.6 DD4.7(TXRXP_C)
PHY_TXRXP_D: DA8.3 DD4.10(TXRXP_D)
RX_CTL: DD1.A2(IO_L8N_T1_AD14N_35) R57.2
RXD0: DD1.B1(IO_L9N_T1_DQS_AD7N_35) R59.2
RXD1: DD1.C1(IO_L9P_T1_DQS_AD7P_35) R60.2
RXD2: DD1.D1(IO_L10N_T1_AD15N_35) R61.2
RXD3: DD1.E2(IO_L10P_T1_AD15P_35) R62.2
TX_CTL: DD4.25(TXCTL) R49.1
TXCLK: DD4.24(TXCLK) R48.1
TXD0: DD4.19(TXD0) R50.1
TXD1: DD4.20(TXD1) R51.1
TXD2: DD4.21(TXD2) R52.1
TXD3: DD4.22(TXD3) R53.1
TXRXM_A: DA8.13 X5.1
TXRXM_B: DA8.16 X5.3
TXRXM_C: DA8.19 X5.4
TXRXM_D: DA8.22 X5.7
TXRXP_A: DA8.14 X5.2
TXRXP_B: DA8.17 X5.6
TXRXP_C: DA8.20 X5.5
TXRXP_D: DA8.23 X5.8
NetC1_2: C1.2 DA1.2(IN) R7.2 X2.3(VCC)
NetC3_2: C3.2 DA3.1(EN) R3.1
NetC4_2: C4.2 DA4.1(EN) R4.1
NetC5_2: C5.2 DA5.1(EN) R5.1
NetC15_1: C15.1 DA1.7(VCC)
NetC16_2: C16.2 DA6.6(EN/SYNC) R6.1
NetC33_1: C33.1 DA6.7(VCC)
NetC56_1: C56.1 DA1.3(SW) L5.1
NetC56_2: C56.2 R8.2
NetC57_2: C57.2 C62.2 L1.2 R14.2 R24.1
NetC58_2: C58.2 C63.2 L2.2 R16.2 R25.1
NetC59_2: C59.2 C64.2 L3.2 R18.2 R26.1
NetC60_2: C60.2 C65.2 L4.2 R20.2 R27.1
NetC61_1: C61.1 DA6.3(SW) L6.1
NetC61_2: C61.2 R11.2
NetC62_1: C62.1 DA2.5(FB) R14.1 R15.2
NetC63_1: C63.1 DA3.5(FB) R16.1 R17.2
NetC64_1: C64.1 DA4.5(FB) R18.1 R19.2
NetC65_1: C65.1 DA5.5(FB) R20.1 R21.2
NetC66_2: C66.2 L5.2 R22.2 VD2.2(A)
NetC67_2: C67.2 L6.2 R29.2 R31.1
NetC72_2: C72.2 DD4.42(RESET_N) R56.1 VD8.2(A) VD9.2(A)
NetC73_2: C73.2 DD1.L9(PROG_B_0) R63.1 SW1.2
NetC74_2: C74.2 DD4.46(XI) Z1.1
NetC75_2: C75.2 DD4.45(XO) Z1.2
NetC76_1: C76.1 C77.1 C79.2 C81.1 DD4.16,34,40(DVDDH) L8.2
NetC78_1: C78.1 C80.2 C82.1 DD4.1,_12(AVDDH) L7.1
NetC83_2: C83.2 DA8.1
NetC84_2: C84.2 DA8.4
NetC85_2: C85.2 DA8.7
NetC86_2: C86.2 C87.2 C89.2 C90.2 C93.2 C96.2 DD4.18,23,26,30,39(DVDDL) L9.1
NetC88_2: C88.2 DA8.10
NetC91_2: C91.2 C94.2 C97.2 DD4.4,9(AVDDL) L10.1
NetC92_2: C92.2 C95.1 C98.2 DD4.44(AVDDL_PLL) L11.1
NetC99_2: C99.2 R80.1 R81.1 R83.1 R84.1
NetDA1_1: DA1.1(AAM) R10.2
NetDA1_5: DA1.5(BST) R8.1
NetDA1_6: DA1.6(EN/SYNC) R7.1
NetDA1_8: DA1.8(FB) R9.1
NetDA2_3: DA2.3(SW) L1.1
NetDA3_3: DA3.3(SW) L2.1
NetDA4_3: DA4.3(SW) L3.1
NetDA5_3: DA5.3(SW) L4.1
NetDA6_1: DA6.1(AAM) R12.1
NetDA6_5: DA6.5(BST) R11.1
NetDA6_8: DA6.8(FB) R13.1
NetDA7_1: DA7.1(WS) R43.2
NetDA7_4: DA7.4(BCLK) R44.2
NetDA7_6: DA7.6(DO) R45.2
NetDA8_15: DA8.15 R84.2
NetDA8_18: DA8.18 R83.2
NetDA8_21: DA8.21 R81.2
NetDA8_24: DA8.24 R80.2
NetDD1_A7: DD1.A7(IO_L1N_T0_AD4N_35) R43.1
NetDD1_B6: DD1.B6(IO_L2P_T0_AD12P_35) R44.1
NetDD1_B7: DD1.B7(IO_L1P_T0_AD4P_35) R45.1
NetDD1_C4: DD1.C4(IO_L12N_T1_MRCC_35) R58.2
NetDD1_E1: DD1.E1(IO_L15N_T2_DQS_35) R49.2
NetDD1_E8: DD1.E8(CCLK_0) DD2.6
NetDD1_F2: DD1.F2(IO_L15P_T2_DQS_35) R48.2
NetDD1_G1: DD1.G1(IO_L17N_T2_35) R53.2
NetDD1_H1: DD1.H1(IO_L20N_T3_35) R52.2
NetDD1_H2: DD1.H2(IO_L20P_T3_35) VD8.1(K)
NetDD1_H10: DD1.H10(DONE_0) VD6.1(K)
NetDD1_J1: DD1.J1(IO_L22N_T3_35) R51.2
NetDD1_J13: DD1.J13(IO_L1P_T0_D00_MOSI_14) DD2.5
NetDD1_J14: DD1.J14(IO_L1N_T0_D01_DIN_14) DD2.2
NetDD1_K1: DD1.K1(IO_L22P_T3_35) R50.2
NetDD1_K10: DD1.K10(INIT_B_0) VD7.1(K)
NetDD1_K15: DD1.K15(IO_L2P_T0_D02_14) DD2.3 R42.1
NetDD1_K16: DD1.K16(IO_L2N_T0_D03_14) DD2.7 R41.1
NetDD1_L7: DD1.L7(TCK_0) X3.6(TCK)
NetDD1_L12: DD1.L12(IO_L6P_T0_FCS_B_14) DD2.1 R38.1
NetDD1_L15: DD1.L15(IO_L3P_T0_DQS_PUDC_B_14) R39.1 R40.2
NetDD1_M7: DD1.M7(TMS_0) X3.4(TMS)
NetDD1_M11: DD1.M11(M2_0) X4.2(M[2])
NetDD1_N7: DD1.N7(TDI_0) X3.10(TDI)
NetDD1_N8: DD1.N8(TDO_0) X3.8(TDO)
NetDD1_N11: DD1.N11(IO_L13P_T2_MRCC_14) DD3.3(OUT)
NetDD3_1: DD3.1(OE) R47.1
NetDD4_27: DD4.27(RXD3) R62.1 R64.2 R65.1
NetDD4_28: DD4.28(RXD2) R61.1 R66.2 R67.1
NetDD4_31: DD4.31(RXD1) R60.1 R68.2 R69.1
NetDD4_32: DD4.32(RXD0) R59.1 R70.2 R71.1
NetDD4_33: DD4.33(RX_CTL) R57.1 R73.1
NetDD4_35: DD4.35(RXCLK) R58.1 R72.1
NetDD4_38: DD4.38(INT_N) R78.1 R79.2
NetDD4_41: DD4.41(CLK125_NDO) R77.2
NetDD4_48: DD4.48(ISET) R74.1
NetR1_2: R1.2 X1.B5(CC2)
NetR2_2: R2.2 X1.A5(CC1)
NetR9_2: R9.2 R22.1 R23.2
NetR13_2: R13.2 R28.1 R29.1
NetR30_1: R30.1 VD2.1(C)
NetR32_1: R32.1 VD3.2(A)
NetR35_1: R35.1 VD4.2(A)
NetR37_1: R37.1 VD5.2(A)
NetR54_1: R54.1 VD6.2(A)
NetR55_1: R55.1 VD7.2(A)
NetR82_1: R82.1 X5.12
NetR85_1: R85.1 X5.10
NetVD1_2: VD1.2(A) X1.A9(VBUS) X1.B9(VBUS)

Not connected (* = marked no-connect by the designer): DD1 A3(IO_L4N_T0_35) A8(IO_L2P_T0_AD8P_15) A9(IO_L2N_T0_AD8N_15) B2(IO_L8P_T1_AD14P_35) B4(IO_L4P_T0_35) B5(IO_L2N_T0_AD12N_35) B9(IO_L3P_T0_DQS_AD1P_15) B14(IO_L8N_T1_AD10N_15) B15(IO_L9P_T1_DQS_AD3P_15) B16(IO_L10N_T1_AD11N_15) C2(IO_L7N_T1_AD6N_35) C3(IO_L7P_T1_AD6P_35) C6(IO_L5N_T0_AD13N_35) C7(IO_L5P_T0_AD13P_35) C8(IO_L1P_T0_AD0P_15) C9(IO_L1N_T0_AD0N_15) C11(IO_L11P_T1_SRCC_15) C12(IO_L11N_T1_SRCC_15) C13(IO_L12N_T1_MRCC_15) C14(IO_L8P_T1_AD10P_15) C16(IO_L10P_T1_AD11P_15) D3(IO_L11N_T1_SRCC_35) D4(IO_L12P_T1_MRCC_35) D5(IO_L6N_T0_VREF_35) D6(IO_L6P_T0_35) D8(IO_L6P_T0_15) D9(IO_L6N_T0_VREF_15) D10(IO_0_15) D11(IO_L14N_T2_SRCC_15) D13(IO_L12P_T1_MRCC_15) D14(IO_L15P_T2_DQS_15) D15(IO_L15N_T2_DQS_ADV_B_15) D16(IO_L17N_T2_A25_15) E3(IO_L11P_T1_SRCC_35) E5(IO_L13N_T2_MRCC_35) E6(IO_0_35) E11(IO_L14P_T2_SRCC_15) E12(IO_L13P_T2_MRCC_15) E13(IO_L13N_T2_MRCC_15) E15(IO_L18N_T2_A23_15) E16(IO_L17P_T2_A26_15) F3(IO_L14N_T2_SRCC_35) F4(IO_L14P_T2_SRCC_35) F5(IO_L13P_T2_MRCC_35) F12(IO_L16P_T2_A28_15) F13(IO_L16N_T2_A27_15) F14(IO_L21N_T3_DQS_A18_15) F15(IO_L18P_T2_A24_15) G2(IO_L17P_T2_35) G4(IO_L16N_T2_35) G5(IO_L16P_T2_35) G11(IO_25_15) G12(IO_L19N_T3_A21_VREF_15) G14(IO_L21P_T3_DQS_15) G15(IO_L24N_T3_RS0_15) G16(IO_L22N_T3_A16_15) H3(IO_L21N_T3_DQS_35) H4(IO_L18N_T2_35) H5(IO_L18P_T2_35) H11(IO_L19P_T3_A22_15) H12(IO_L20P_T3_A20_15) H13(IO_L20N_T3_A19_15) H14(IO_L24P_T3_RS1_15) H16(IO_L22P_T3_A17_15) J3(IO_L21P_T3_DQS_35) J4(IO_L19N_T3_VREF_35) J5(IO_L19P_T3_35) J15(IO_L23P_T3_FOE_B_15) J16(IO_L23N_T3_FWE_B_15) K2(IO_L24N_T3_35) K3(IO_L24P_T3_35) K5(IO_25_35) K12(IO_0_14) K13(IO_L5P_T0_D06_14) L2(IO_L23N_T3_35) L3(IO_L23P_T3_35) L13(IO_L5N_T0_D07_14) L14(IO_L4P_T0_D04_14) M6(IO_L19P_T3_A10_D26_14) M12(IO_L6N_T0_D08_VREF_14) M14(IO_L4N_T0_D05_14) M15(IO_L3N_T0_DQS_EMCCLK_14) M16(IO_L7P_T1_D09_14) N6(IO_L19N_T3_A09_D25_VREF_14) N9(IO_L18P_T2_A12_D28_14) N12(IO_L13N_T2_MRCC_14) N13(IO_L11P_T1_SRCC_14) N14(IO_L12P_T1_MRCC_14) N16(IO_L7N_T1_D10_14) P6(IO_25_14) P8(IO_L20P_T3_A08_D24_14) P9(IO_L18N_T2_A11_D27_14) P10(IO_L14P_T2_SRCC_14) P11(IO_L14N_T2_SRCC_14) P13(IO_L11N_T1_SRCC_14) P14(IO_L12N_T1_MRCC_14) P15(IO_L8P_T1_D11_14) P16(IO_L8N_T1_D12_14) R5(IO_L23P_T3_A03_D19_14) R6(IO_L24P_T3_A01_D17_14) R7(IO_L24N_T3_A00_D16_14) R8(IO_L20N_T3_A07_D23_14) R10(IO_L17P_T2_A14_D30_14) R11(IO_L17N_T2_A13_D29_14) R12(IO_L15P_T2_DQS_RDWR_B_14) R13(IO_L16P_T2_CSI_B_14) R15(IO_L9P_T1_DQS_14) R16(IO_L9N_T1_DQS_D13_14) T5(IO_L23N_T3_A02_D18_14) T7(IO_L21P_T3_DQS_14) T8(IO_L21N_T3_DQS_A06_D22_14) T9(IO_L22P_T3_A05_D21_14) T10(IO_L22N_T3_A04_D20_14) T12(IO_L15N_T2_DQS_DOUT_CSO_B_14) T13(IO_L16N_T2_A15_D31_14) T14(IO_L10P_T1_D14_14) T15(IO_L10N_T1_D15_14); DD4 43(LDO)

## Notes on the sheet
- Общий
- Labels drawn without touching a wire or pin: A10, A12, A13, A14, A15, B10, B11, B12
- Перв. примен.
- Справ. №
- Подп. и дата
- Инв. № дубл.
- Взам. инв. №
- Разраб.
- Изм.
- Лист
- № докум.
- Подп.
- Дата
- Лит.
- Масса
- Масштаб
- Пров.
- Т. контр.
- Листов
- Инв. № подл.
- Н. контр.
- Утв.
- Копировал
- Формат А0
- (in symbol DC3-14P) Цепь; Конт.; +3.3 В; 1; 3; 5; Общий
- (in symbol DC005 5,5x2,1 mm) Цепь; Конт.; 1; +12В; Общий; 2
- (in symbol DS1021-1X3SF11-B) Цепь; Конт.; +3.3В; M2; Общий
- (in symbol DS1021-1X10SF11-B) Конт.; Цепь; +3.3В; DS1021-1X10
- (in symbol HX5008NLT) TCT1; *TR; MCT1; TD1+; MX1+; TD1-; MX1-; TCT2; MCT2; TD2+; MX2+; TD2-; MX2-; TCT3; MCT3; TD3+; MX3+; TD3-; MX3-; TCT4; MCT4; TD4+; MX4+; TD4-; MX4-
- (in symbol KSZ9131RXNI) RTX; TX_CTL; INT_N/PME_N2/ALLPHYAD; CLK125_NDO/LED_MODE; RX_CTL/CLK125_EN; RXCLK/PHYAD2; TXRXM_C; RXD0/MODE0; RXD1/MODE1; RXD2/MODE2; LED1/PME_N1/PHYAD0; RXD3/MODE3; LED2/PHYAD1; LDO_O
- (in symbol MP2315GJ) *STU
- (in symbol MX25L12835F) VCC; EEPROM; CS; RST/SIO3; SO/SIO1; SCLK; WP#/SIO2; SI/SIO0; GND
- (in symbol NCP1529) *STU
- (in symbol RJHSE-5381) Конт.; Цепь; TXRXP_A; TXRXM_A; TXRXP_B; TXRXP_C; TXRXM_C; TXRXM_B; TXRXP_D; TXRXM_D; LED_G-; LED_G+; LED_Y-; LED_Y+; 13; CT
- (in symbol SG-8018CA TJHPA) G
- (in symbol SPH0645LM4H) ADC
- (in symbol USB Type-C) Цепь; Конт.; +5В; 1; 2; СС1; 3; СС2; 4; Общий; 5; 6
- (in symbol XC7A35T-1FTG256C, part A) PLM
- (in symbol XC7A35T-1FTG256C, part B) PLM
- (in symbol XC7A35T-1FTG256C, part D) PLM
- (in symbol XC7A35T-1FTG256C, part E) PLM
- (in symbol XC7A35T-1FTG256C, part F) PLM

## Library data of the parts
C1 = GRM31CR61E476ME44L: Компания: Murata; Напряжение: 16 В; Диэлектрик: X5R; Значение: 47 мкФ
C2 C24-C26 C57-C60 = CL10A475KP8NNNC: 4.7 мкф; Компания: Samsung; Напряжение: 10 В; Диэлектрик: X5R; Значение: 4.7 мкФ
C3-C5 C16 C81 C82 C98 = CL10A106KQ8NNNC: 10 мкф 0603 X5R; Компания: Samsung; Напряжение: 6.3 В; Диэлектрик: X5R
  C81 C82 C98: Значение: 10 мкФ
C6-C8 C10-C14 = GRM21BR60J476ME15L: Компания: Murata; Напряжение: 6.3 В; Диэлектрик: X5R; Значение: 47 мкФ
C9 = GRM31CR60J107ME39L: Компания: Murata; Напряжение: 6.3 В; Диэлектрик: X5R; Значение: 100 мкФ
C15 C33 C56 C61 C68 C70 C71 C73 C76-C80 C83-C91 C93-C95 = CC0603KRX7R9BB104: Компания: Yageo; Напряжение: 50 В; Диэлектрик: X7R
C17 C19-C23 C27-C32 C72 = CL10A475KP8NNNC: Компания: Samsung; Напряжение: 10 В; Диэлектрик: X5R; Значение: 4.7 мкФ
C18 C34-C55 = CC0603KRX7R6BB474: Компания: Yageo; Напряжение: 10 В; Диэлектрик: X7R; Значение: 0.47 мкФ
C62-C65 = CL21C270JBANNNC: 27 пф; Компания: Samsung; Напряжение: 50 В; Диэлектрик: X5R; Значение: 27 пФ
C66 C67 = GRM21BR60J476ME15L: 47 мкф; Компания: Murata; Напряжение: 6.3 В; Диэлектрик: X5R; Значение: 47 мкФ
C69 = CL21C270JBANNNC: Компания: Samsung; Напряжение: 50 В; Диэлектрик: X5R; Значение: 27 пФ
C74 C75 = CC0603KRNPO9BN330: Компания: Yageo; Напряжение: 50 В; Диэлектрик: X7R; Значение: 33 пФ
C92 C100 C101 = CL10B103KB8NNND: 0.01 мкф 0603 X5R; Компания: Samsung; Напряжение: 50 В; Значение: 0.01 мкф; Диэлектрик: X5R
C96 C97 = CC0805KKX5R5BB226: 22 мкФ 0805 X5R; Компания: Yageo; Напряжение: 6.3 В; Диэлектрик: X7R; Значение: 22 мкФ
C99 = GR442QR73D102KW01L: Компания: Murata; Напряжение: 2 кВ; Диэлектрик: X5R; Значение: 1000 пФ
DA1 DA6 = MP2315GJ: Компания: Monolithic; Тип: Импульсный регулятор; Категория: Микросхема аналоговая
DA2-DA5 = NCP1529: Компания: ONSemi; Тип: Импульсный регулятор; Категория: Микросхема аналоговая
DA7 = SPH0645LM4H: Компания: Knowles; Тип: Цифровой микрофон; Категория: Микросхема цифровая
DA8 = HX5008NLT: Компания: Pulse Electronics; Тип: Трансформаторная сборка; Категория: Микросхема аналоговая
DD1 = XC7A35T-1FTG256C: IC FPGA 170 I/O 256FTBGA; Компания: Xilinx; Тип: ПЛИС; Категория: Микросхема цифровая
DD2 = MX25L12835F: Тип: Флеш-память; Категория: Микросхема цифровая; Компания: Macronix
DD3 = SG-8018CA TJHPA: Clock gen 50 MHz; Тип: Кварцевый генератор; Категория: Микросхема цифровая; Компания: Epson
DD4 = KSZ9131RXNI: Компания: TI; Тип: Приёмопередатчик физического уровня Ethernet; Категория: Микросхема цифровая
L1-L6 = VLS6045EX-4R7M-H: 4.7 мкГн; Компания: TDK; Значение: 4.7 мкГн
L7-L11 = MMZ1608Y221BT: Тип: Фильтр ферритовый; Компания: TDK
R1 R2 = RC0805FR-075K1L: 5.1 кОм 1%; Компания: Yageo; Точность: 5%; Мощность: 0.125 Вт; Значение: 5.1 кОм
R3 R6 R7 R14 R20 R21 = RC0805FR-07120KL: Компания: Yageo; Точность: 1%; Мощность: 0.125 Вт; Значение: 120 кОм
R4 R5 = RC0603FR-07220KL: 220 кОм; Компания: Yageo; Точность: 5%; Мощность: 0.125 Вт; Значение: 220 кОм
R8 R11 R48-R53 R57-R62 = RC0805JR-0720RL: Компания: Yageo; Точность: 5%; Мощность: 0.125 Вт; Значение: 20 Ом
R9 = RC0603FR-0720KL: Компания: Yageo; Точность: 5%; Мощность: 0.125 Вт; Значение: 20 кОм
R10 R12 = RC0805FR-0768KL: Компания: Yageo; Точность: 5%; Мощность: 0.125 Вт; Значение: 68 кОм
R13 = RC0805FR-0733KL: Компания: Yageo; Точность: 5%; Мощность: 0.125 Вт; Значение: 33 кОм
R15 R17 = RC0603FR-07180KL: 180 кОм; Компания: Yageo; Точность: 1%; Мощность: 0.125 Вт; Значение: 180 кОм
R16 = RC0805FR-07360KL: 360 кОм; Компания: Yageo; Точность: 1%; Мощность: 0.125 Вт; Значение: 360 кОм
R18 = RC0805FR-07560KL: Компания: Yageo; Точность: 1%; Мощность: 0.125 Вт; Значение: 560 кОм
R19 = RC0603FR-07180KL: Компания: Yageo; Точность: 1%; Мощность: 0.125 Вт; Значение: 180 кОм
R22 R29 = RC0603FR-0739KL: Компания: Yageo; Точность: 1%; Мощность: 0.125 Вт; Значение: 39 кОм
R23 R56 = RC0603FR-077K5L: Компания: Yageo; Точность: 5%; Мощность: 0.125 Вт; Значение: 7.5 кОм
R24-R27 R30 R31 = RC0805FR-070RL: Компания: Yageo; Точность: 5%; Мощность: 0.125 Вт; Значение: 0 Ом
R28 = RC0603FR-0712K4L: Компания: Yageo; Точность: 5%; Мощность: 0.125 Вт; Значение: 12.4 кОм
R32 R35 R37 R82 R85 = RC0805FR-07220RL: Компания: Yageo; Точность: 5%; Мощность: 0.125 Вт; Значение: 220 Ом
R38 R41 R42 R47 R63 = RS-05K472JT: Компания: Yageo; Точность: 5%; Мощность: 0.125 Вт; Значение: 4.7 кОм
R39 R40 R46 R54 R55 R64-R73 R75-R79 = RC0805JR-071KL: Компания: Yageo; Точность: 5%; Мощность: 0.125 Вт; Значение: 1 кОм
R43-R45 = RC0805FR-0751RL: Компания: Yageo; Точность: 5%; Мощность: 0.125 Вт; Значение: 51 Ом
R74 = RC0805FR-076K04L: Компания: Bourns; Точность: 1%; Мощность: 0.125 Вт; Значение: 6.04 кОм
R80 R81 R83 R84 = RC1206JR-0775RL: Компания: Yageo; Точность: 5%; Мощность: 0.25 Вт; Значение: 75 Ом
SW1 = IT-1187-160GM-G: Компания: Switronic; Категория: Кнопка тактовая
VD1 VD2 = PMEG3050EP: Компания: Nexperia; Тип: Диод Шоттки
VD3-VD5 = TO-1608BC-PG: Компания: Oasis tech.; Тип: Светодиод
VD6 VD7 = TO-1608BC-BF: Компания: Oasis tech.; Тип: Светодиод
VD8 VD9 = 1N4148W: Компания: Oasis tech.
X1 = USB Type-C: Компания: Китай; Тип: Разъем; Категория: Разъем
X2 = DC005 5,5x2,1 mm: DC Power Jack; Компания: Китай; Тип: Разъем; Категория: Разъем
X3 = DC3-14P: Компания: Китай; Тип: Разъем; Категория: Разъем
X4 = DS1021-1X3SF11-B: Компания: Connfly; Тип: Разъем; Категория: Разъем
X5 = RJHSE-5381: Компания: Amphenol; Тип: Разъем; Категория: Разъем
X6 = DS1021-1X10SF11-B: Компания: Connfly; Тип: Разъем; Категория: Разъем
Z1 = WTL9S85401FO: Тип: Кварцевый резонатор; Компания: WTL; Категория: Микросхема цифровая; Значение: 25 МГц